# EAGLE design tarjeta_dspic33_proto (EAGLE 4.16)

## Sheet 1 of 7
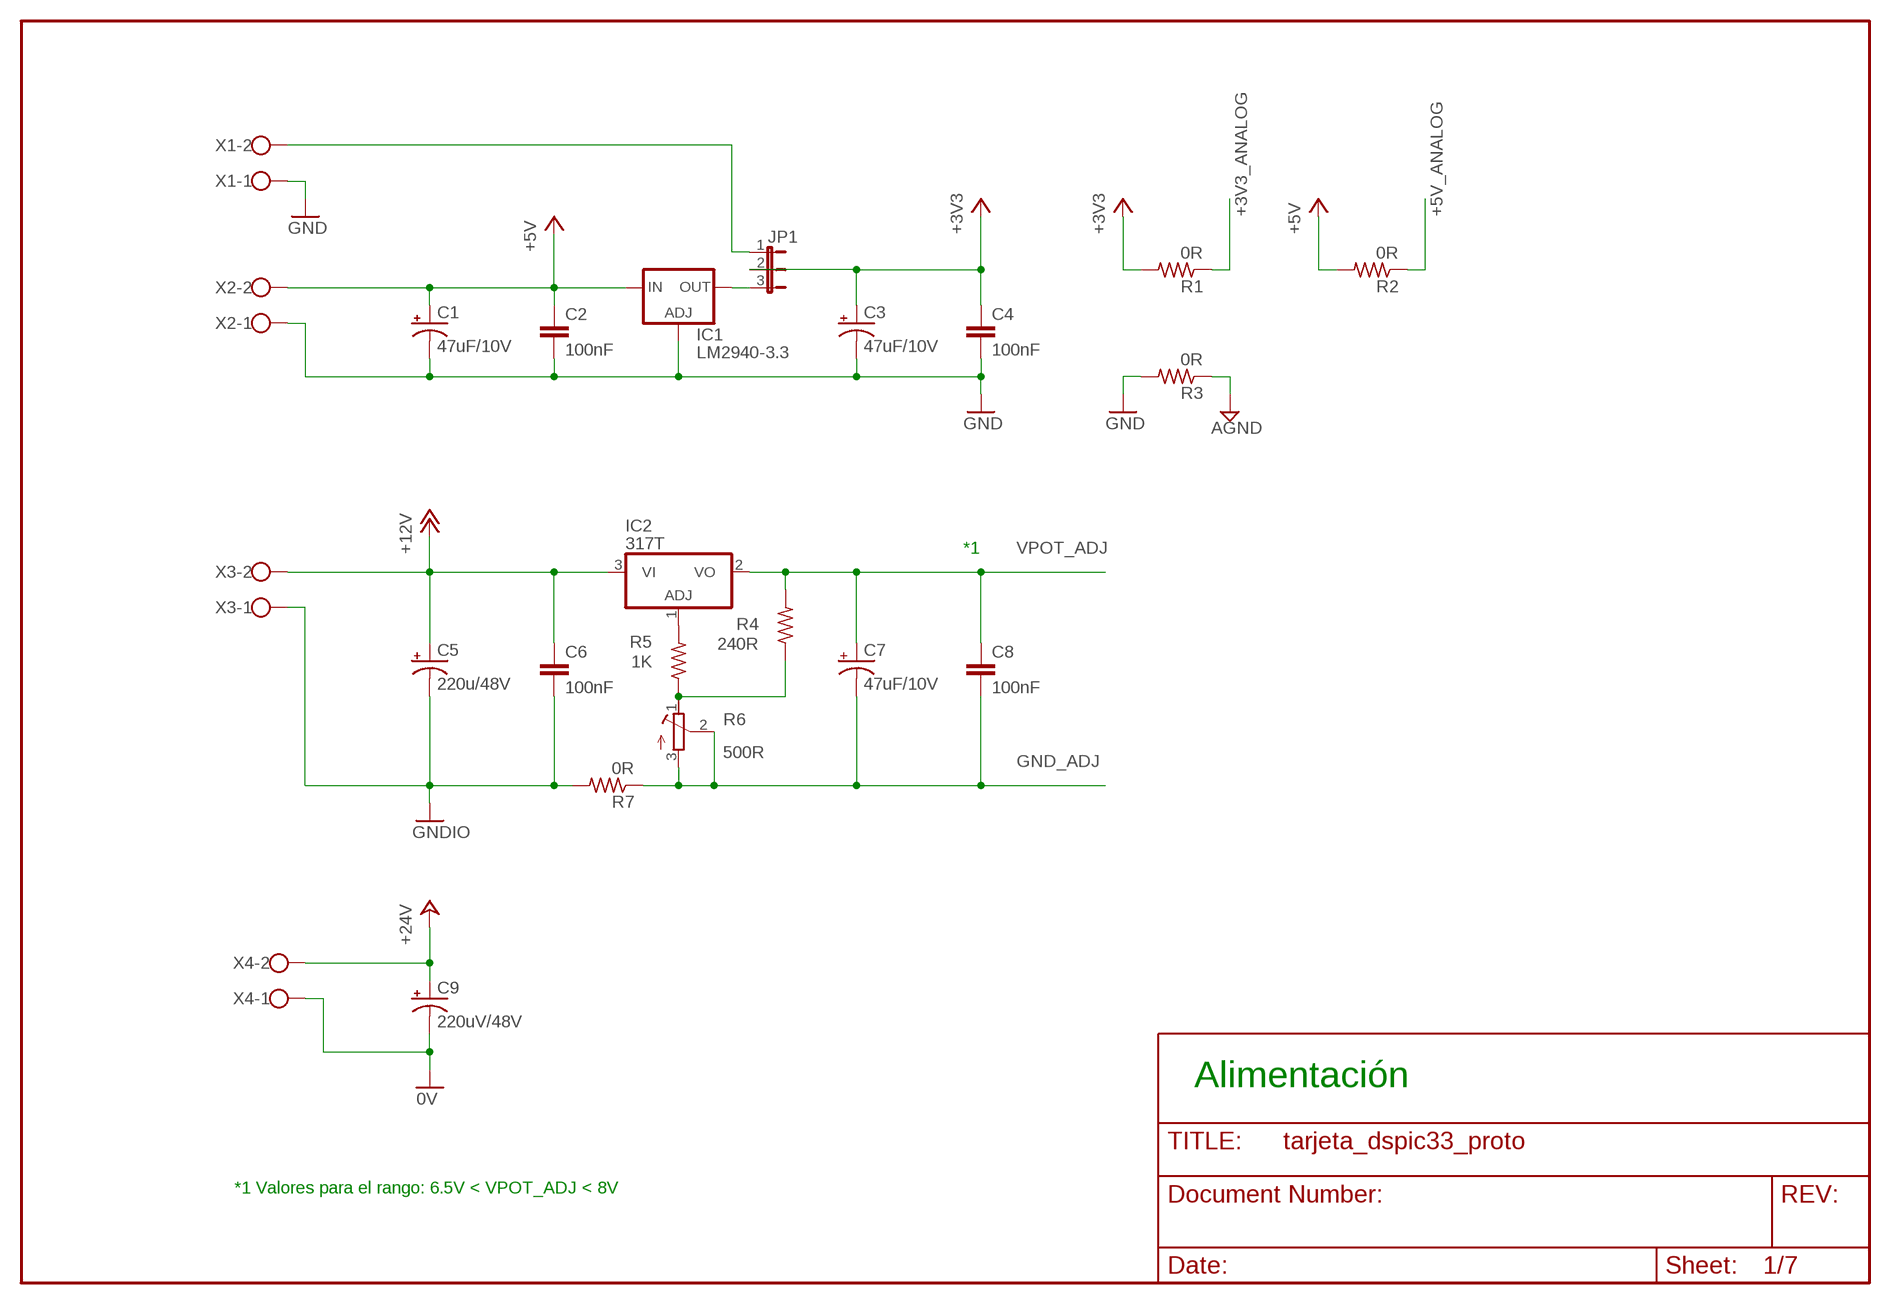
[diagram p0: schematic, sheet 1]

### Parts
C1  47uF/10V  CPOL-USE2-5  [E2-5]
C2  100nF  C-EU050-024X044  [C050-024X044]
C3  47uF/10V  CPOL-USE2-5  [E2-5]
C4  100nF  C-EU050-024X044  [C050-024X044]
C5  220u/48V  CPOL-USE2-5  [E2-5]
C6  100nF  C-EU050-024X044  [C050-024X044]
C7  47uF/10V  CPOL-USE2-5  [E2-5]
C8  100nF  C-EU050-024X044  [C050-024X044]
C9  220uV/48V  CPOL-USE2-5  [E2-5]
IC1  LM2940-3.3  LM317MABT  [TO220L1]
IC2  317T  [TO220H]
JP1  JP2E  [JP2]
R1  0R  R-US_0309/10  [0309/10]
R2  0R  R-US_0309/10  [0309/10]
R3  0R  R-US_0309/10  [0309/10]
R4  240R  R-US_0309/10  [0309/10]
R5  1K  R-US_0309/10  [0309/10]
R6  500R  R-TRIMMT93YA  [RTRIMT93YA]
R7  0R  R-US_0309/10  [0309/10]
X1  W237-02P  [W237-132]
X2  W237-02P  [W237-132]
X3  W237-02P  [W237-132]
X4  W237-02P  [W237-132]

### Nets
0V: C9.- X4.1 ; also sheet 2
+3V3: C3.+ C4.1 JP1.2 R1.2 ; also sheet 3,4,6,7
+3V3_ANALOG: R1.1 ; also sheet 7
+5V: C1.+ C2.1 IC1.3(IN) R2.2 X2.2 ; also sheet 2,3,4
+5V_ANALOG: R2.1 ; also sheet 2,5,7
+12V: C5.+ C6.1 IC2.3(VI) X3.2 ; also sheet 3,4,5
+24V: C9.+ X4.2 ; also sheet 2
AGND: R3.1 ; also sheet 2,5,7
GND: C1.- C2.2 C3.- C4.2 IC1.1(ADJ) R3.2 X1.1 X2.1 ; also sheet 2,3,4,6,7
GND_ADJ: C7.- C8.2 R6.2(S) R6.3(E) R7.1 ; also sheet 3
GNDIO: C5.- C6.2 R7.2 X3.1 ; also sheet 3,4,5
N$3: IC1.2(OUT) JP1.3
N$12: JP1.1 X1.2
N$23: R4.1 R5.1 R6.1(A)
N$24: IC2.1(ADJ) R5.2
VPOT_ADJ: C7.+ C8.1 IC2.2(VO) R4.2 ; also sheet 3

### Notes on the sheet
- *1
- Alimentación
- *1 Valores para el rango: 6.5V < VPOT_ADJ < 8V

## Sheet 2 of 7
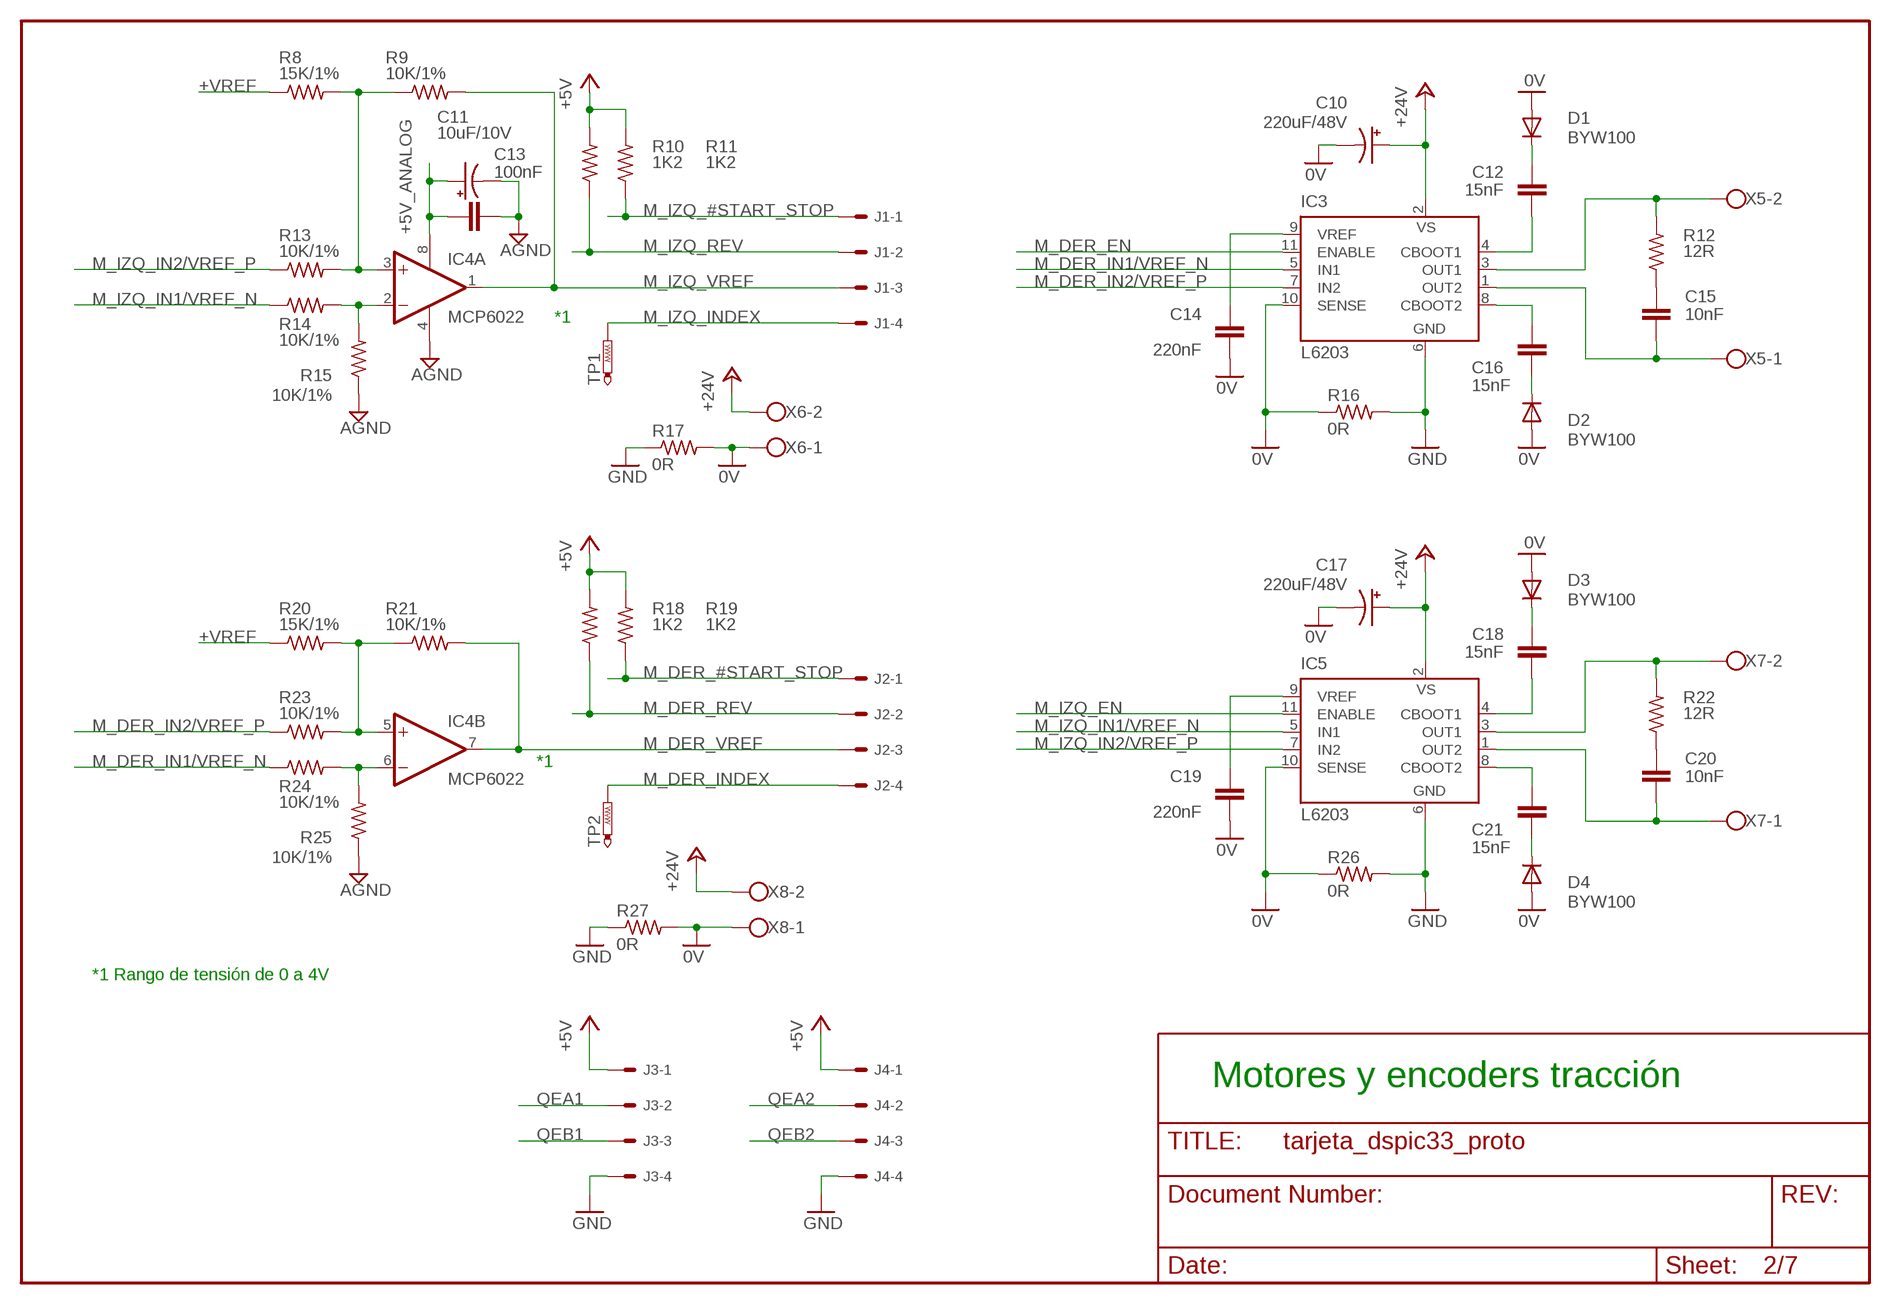
[diagram p1: schematic, sheet 2]

### Parts
C10  220uF/48V  CPOL-USE3.5-10  [E3,5-10]
C11  10uF/10V  CPOL-USE3.5-10  [E3,5-10]
C12  15nF  C-EU050-024X044  [C050-024X044]
C13  100nF  C-EU050-024X044  [C050-024X044]
C14  220nF  C-EU050-024X044  [C050-024X044]
C15  10nF  C-EU050-024X044  [C050-024X044]
C16  15nF  C-EU050-024X044  [C050-024X044]
C17  220uF/48V  CPOL-USE3.5-10  [E3,5-10]
C18  15nF  C-EU050-024X044  [C050-024X044]
C19  220nF  C-EU050-024X044  [C050-024X044]
C20  10nF  C-EU050-024X044  [C050-024X044]
C21  15nF  C-EU050-024X044  [C050-024X044]
D1  BYW100  [F126-10]
D2  BYW100  [F126-10]
D3  BYW100  [F126-10]
D4  BYW100  [F126-10]
IC3  L6203  [MULTIWATT-11]
IC4  MCP6022  OPA2344P  [DIL08]
IC5  L6203  [MULTIWATT-11]
J1  22-27-2041-04  [6410-04]
J2  22-27-2041-04  [6410-04]
J3  22-27-2041-04  [6410-04]
J4  22-27-2041-04  [6410-04]
R8  15K/1%  R-US_0309/10  [0309/10]
R9  10K/1%  R-US_0309/10  [0309/10]
R10  1K2  R-US_0309/10  [0309/10]
R11  1K2  R-US_0309/10  [0309/10]
R12  12R  R-US_0309/10  [0309/10]
R13  10K/1%  R-US_0309/10  [0309/10]
R14  10K/1%  R-US_0309/10  [0309/10]
R15  10K/1%  R-US_0309/10  [0309/10]
R16  0R  R-US_0309/10  [0309/10]
R17  0R  R-US_0309/10  [0309/10]
R18  1K2  R-US_0309/10  [0309/10]
R19  1K2  R-US_0309/10  [0309/10]
R20  15K/1%  R-US_0309/10  [0309/10]
R21  10K/1%  R-US_0309/10  [0309/10]
R22  12R  R-US_0309/10  [0309/10]
R23  10K/1%  R-US_0309/10  [0309/10]
R24  10K/1%  R-US_0309/10  [0309/10]
R25  10K/1%  R-US_0309/10  [0309/10]
R26  0R  R-US_0309/10  [0309/10]
R27  0R  R-US_0309/10  [0309/10]
TP1  PTR1B2,54  [B2,54]
TP2  PTR1B2,54  [B2,54]
X5  W237-02P  [W237-132]
X6  W237-02P  [W237-132]
X7  W237-02P  [W237-132]
X8  W237-02P  [W237-132]

### Nets
0V: C10.- C14.2 C17.- C19.2 D1.A D2.A D3.A D4.A IC3.10(SENSE) IC5.10(SENSE) R16.1 R17.2 R26.1 R27.2 X6.1 X8.1 ; also sheet 1
+5V: J3.1 J4.1 R10.2 R11.2 R18.2 R19.2 ; also sheet 1,3,4
+5V_ANALOG: C11.+ C13.1 IC4.8(A:V+) ; also sheet 1,5,7
+24V: C10.+ C17.+ IC3.2(VS) IC5.2(VS) X6.2 X8.2 ; also sheet 1
+VREF: R8.1 R20.1 ; also sheet 5,7
AGND: C11.- C13.2 IC4.4(A:V-) R15.1 R25.1 ; also sheet 1,5,7
GND: IC3.6(GND) IC5.6(GND) J3.4 J4.4 R16.2 R17.1 R26.2 R27.1 ; also sheet 1,3,4,6,7
M_DER_#START_STOP: J2.1 R19.1 ; also sheet 7
M_DER_EN: IC3.11(ENABLE) ; also sheet 7
M_DER_IN1/VREF_N: IC3.5(IN1) ; also sheet 7
M_DER_IN2/VREF_P: IC3.7(IN2) R23.1 ; also sheet 7
M_DER_INDEX: J2.4 TP2.PP(TP)
M_DER_REV: J2.2 R18.1 ; also sheet 7
M_DER_VREF: IC4.7(B:OUT) J2.3 R21.2
M_IZQ_#START_STOP: J1.1 R11.1 ; also sheet 7
M_IZQ_EN: IC5.11(ENABLE) ; also sheet 7
M_IZQ_IN1/VREF_N: IC5.5(IN1) ; also sheet 7
M_IZQ_IN2/VREF_P: IC5.7(IN2) R13.1 ; also sheet 7
M_IZQ_INDEX: J1.4 TP1.PP(TP)
M_IZQ_REV: J1.2 R10.1 ; also sheet 7
M_IZQ_VREF: IC4.1(A:OUT) J1.3 R9.2
N$4: C14.1 IC3.9(VREF)
N$5: C16.2 D2.C
N$6: C12.2 D1.C
N$7: C16.1 IC3.8(CBOOT2)
N$8: C12.1 IC3.4(CBOOT1)
N$9: IC3.3(OUT1) R12.2 X5.2
N$10: C15.2 R12.1
N$11: C15.1 IC3.1(OUT2) X5.1
N$14: IC4.3(A:+IN) R8.2 R9.1 R13.2
N$15: C19.1 IC5.9(VREF)
N$16: C21.2 D4.C
N$17: C18.2 D3.C
N$18: C21.1 IC5.8(CBOOT2)
N$19: C18.1 IC5.4(CBOOT1)
N$20: C20.2 R22.1
N$21: IC5.3(OUT1) R22.2 X7.2
N$22: C20.1 IC5.1(OUT2) X7.1
N$25: IC4.2(A:-IN) R14.2 R15.2
N$28: IC4.5(B:+IN) R20.2 R21.1 R23.2
N$29: IC4.6(B:-IN) R24.2 R25.2
QEA1: J3.2 ; also sheet 7
QEA2: J4.2 ; also sheet 7
QEB1: J3.3 ; also sheet 7
QEB2: J4.3 ; also sheet 7
Unconnected: R14.1 R24.1

### Notes on the sheet
- *1
- *1
- *1 Rango de tensión de 0 a 4V
- Motores y encoders tracción

## Sheet 3 of 7
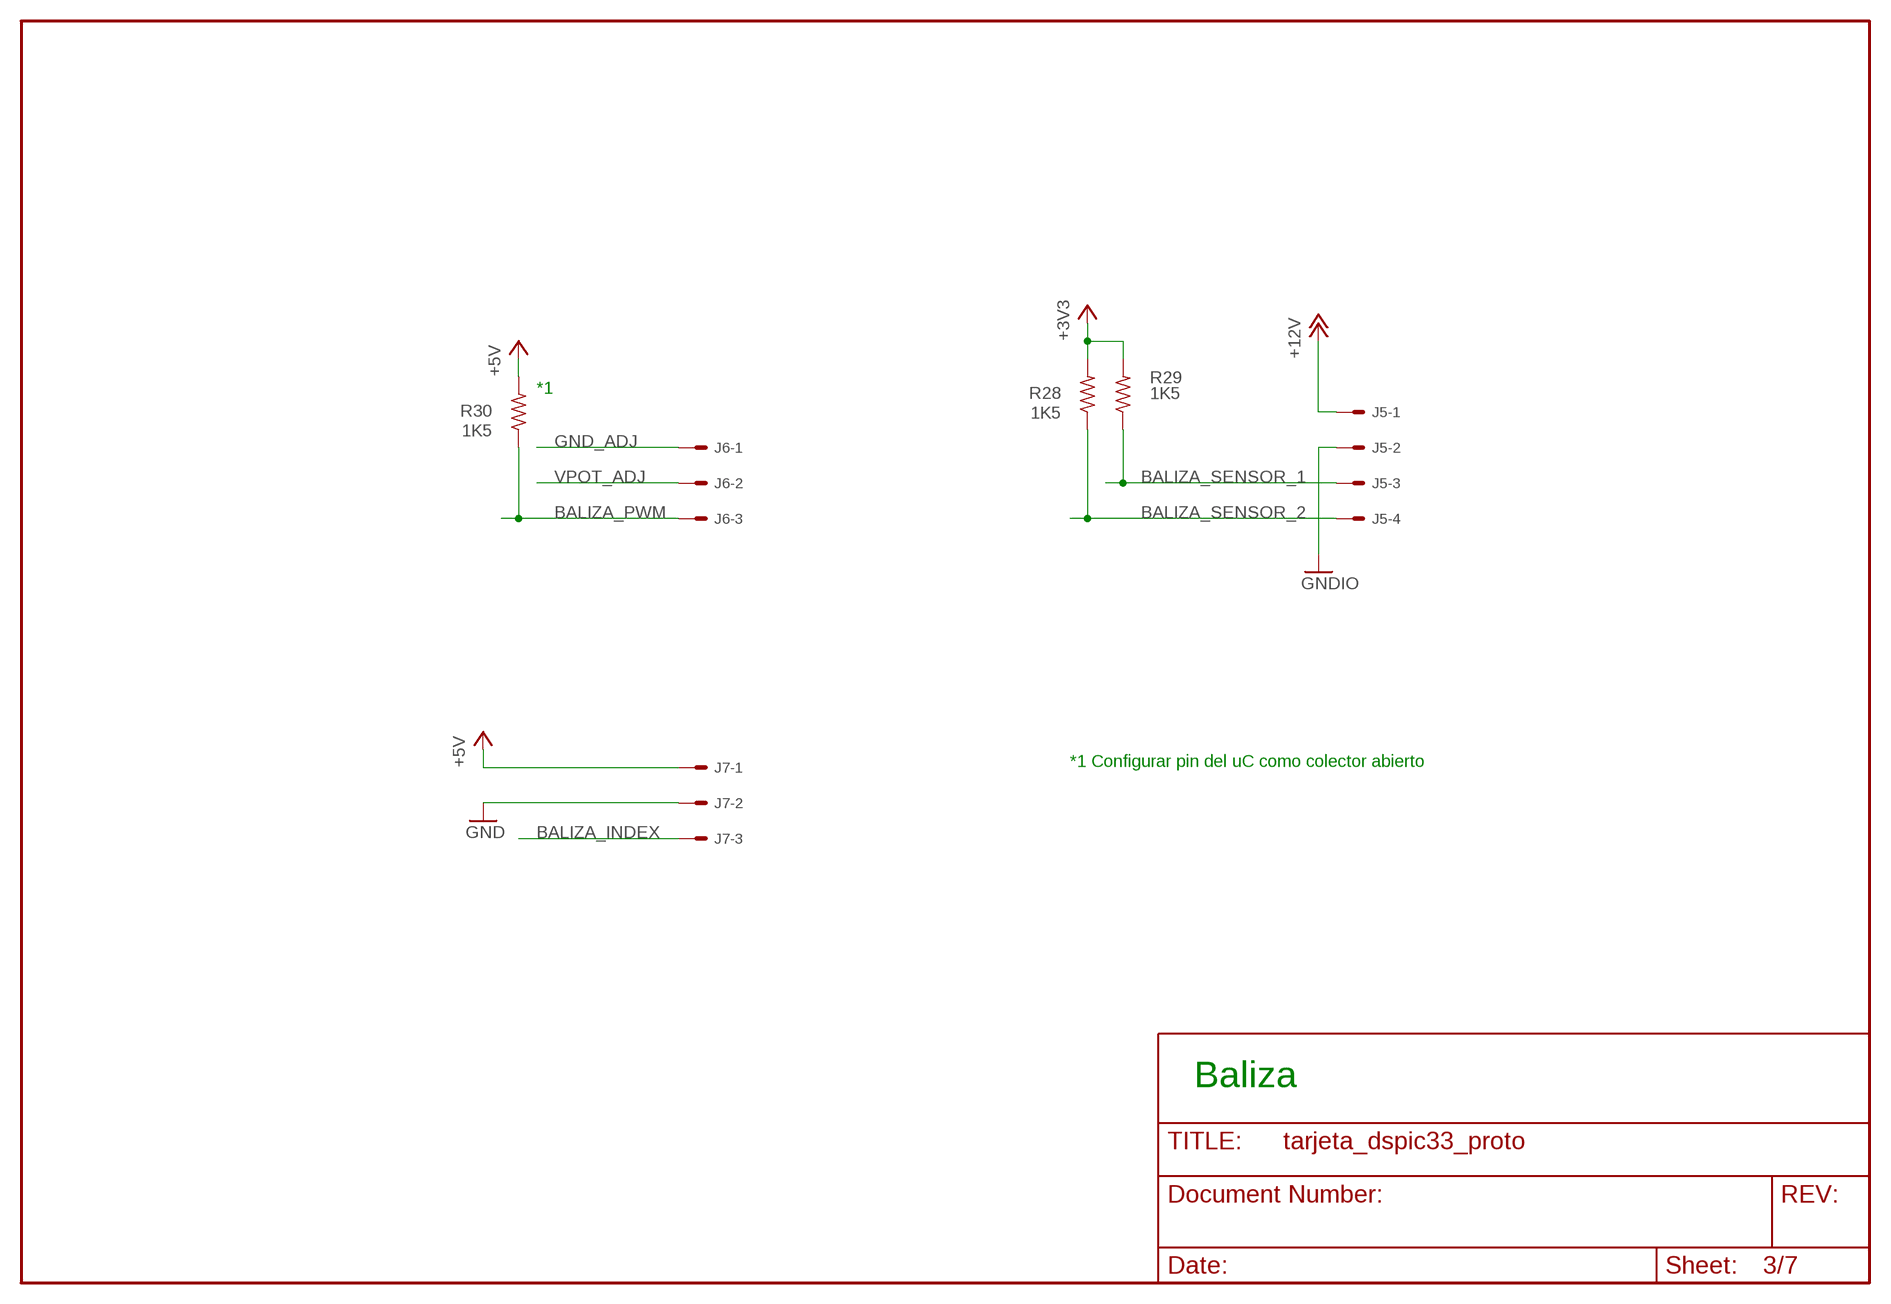
[diagram p2: schematic, sheet 3]

### Parts
J5  22-27-2041-04  [6410-04]
J6  22-27-2031-03  [6410-03]
J7  22-27-2031-03  [6410-03]
R28  1K5  R-US_0207/7  [0207/7]
R29  1K5  R-US_0207/7  [0207/7]
R30  1K5  R-US_0207/7  [0207/7]

### Nets
+3V3: R28.2 R29.2 ; also sheet 1,4,6,7
+5V: J7.1 R30.2 ; also sheet 1,2,4
+12V: J5.1 ; also sheet 1,4,5
BALIZA_INDEX: J7.3 ; also sheet 7
BALIZA_PWM: J6.3 R30.1 ; also sheet 7
BALIZA_SENSOR_1: J5.3 R29.1 ; also sheet 7
BALIZA_SENSOR_2: J5.4 R28.1 ; also sheet 7
GND: J7.2 ; also sheet 1,2,4,6,7
GND_ADJ: J6.1 ; also sheet 1
GNDIO: J5.2 ; also sheet 1,4,5
VPOT_ADJ: J6.2 ; also sheet 1

### Notes on the sheet
- *1
- *1 Configurar pin del uC como colector abierto
- Baliza

## Sheet 4 of 7
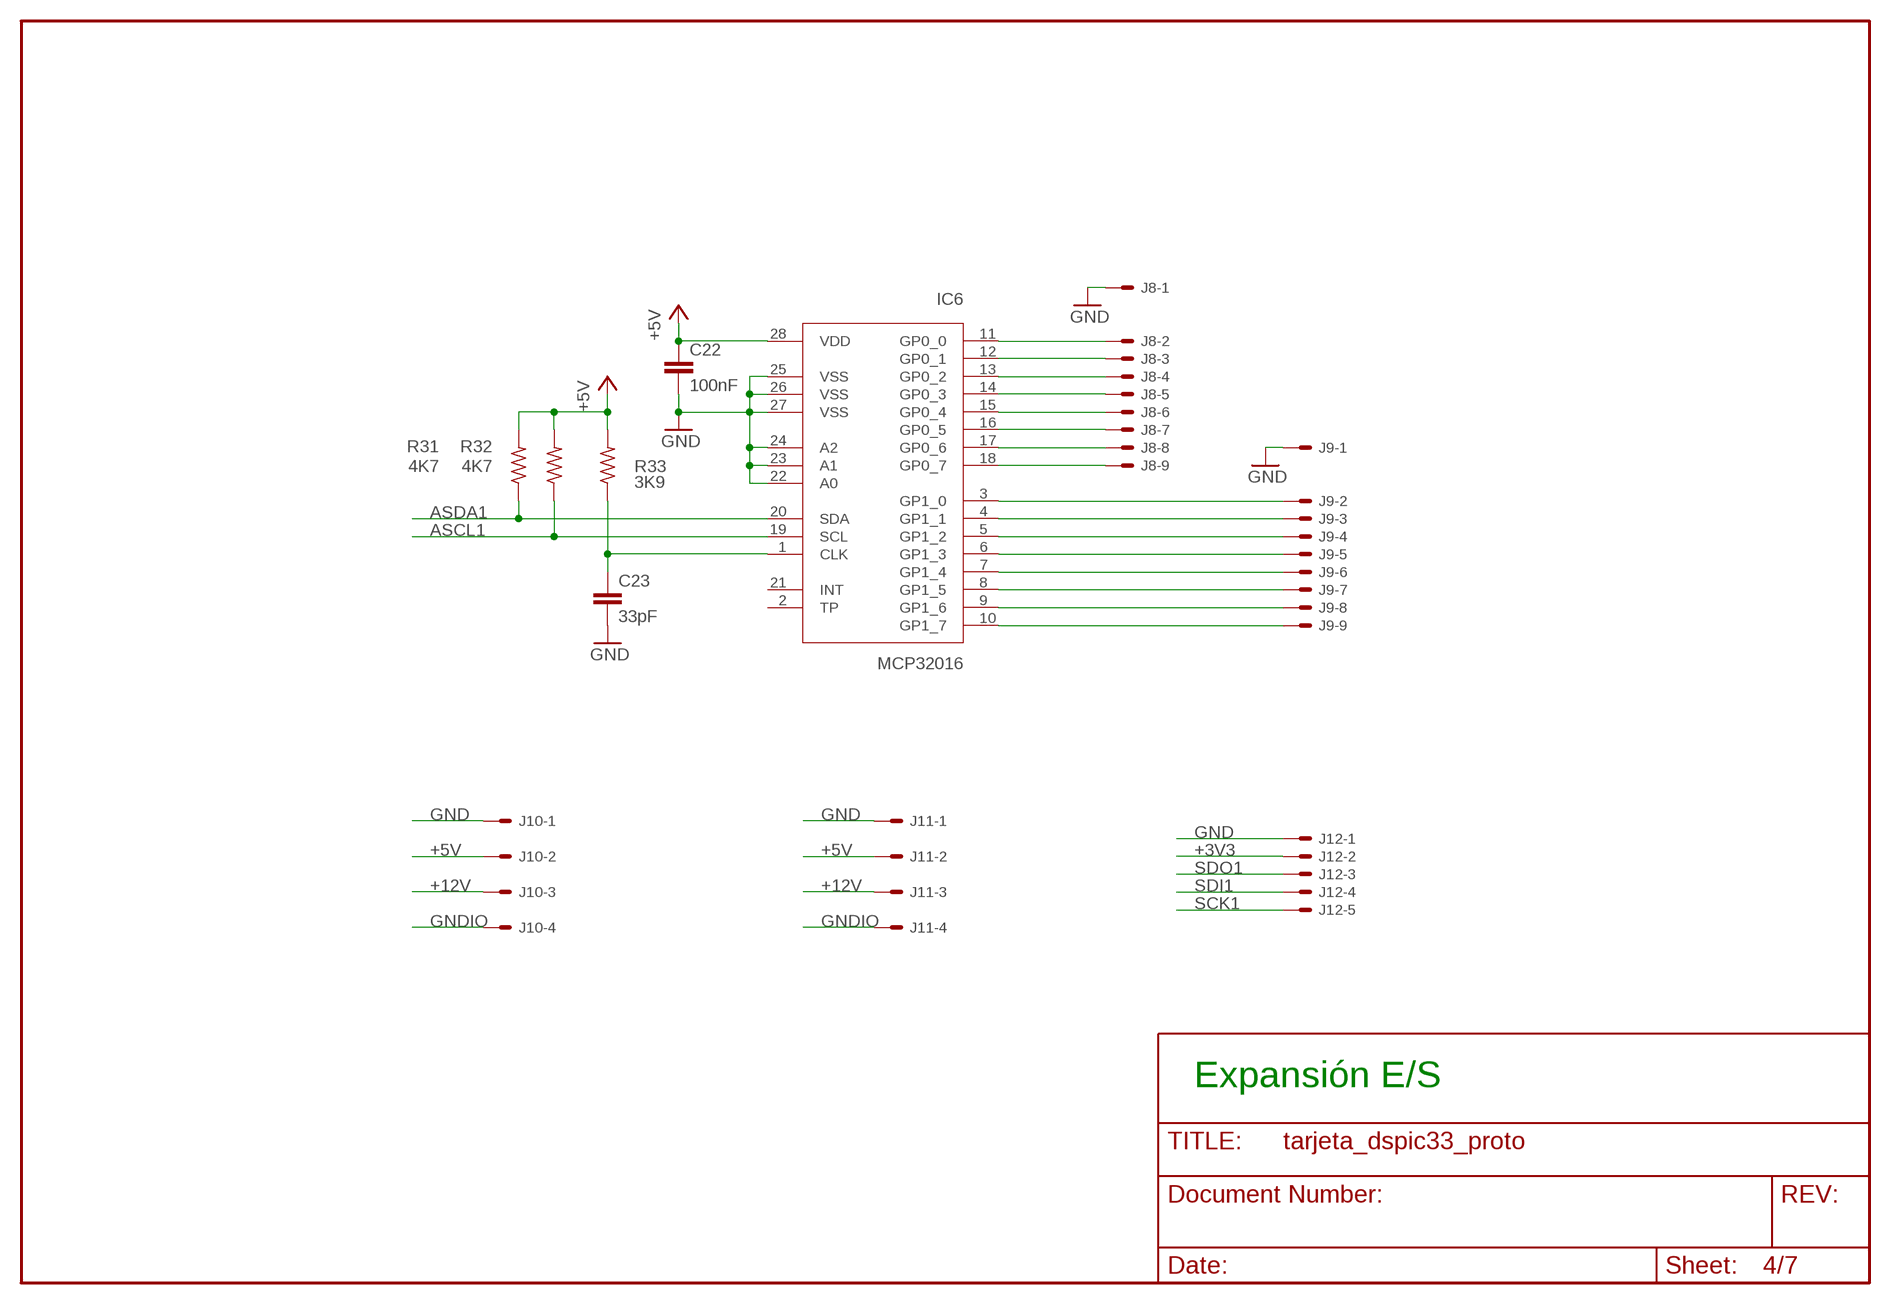
[diagram p3: schematic, sheet 4]

### Parts
C22  100nF  C-EU050-024X044  [C050-024X044]
C23  33pF  C-EU050-024X044  [C050-024X044]
IC6  MCP32016  [DIL28-3]
J8  22-27-2091-09  [6410-09]
J9  22-27-2091-09  [6410-09]
J10  22-27-2041-04  [6410-04]
J11  22-27-2041-04  [6410-04]
J12  22-27-2051-05  [6410-05]
R31  4K7  R-US_0207/7  [0207/7]
R32  4K7  R-US_0207/7  [0207/7]
R33  3K9  R-US_0207/7  [0207/7]

### Nets
+3V3: J12.2 ; also sheet 1,3,6,7
+5V: C22.1 IC6.28(VDD) J10.2 J11.2 R31.2 R32.2 R33.2 ; also sheet 1,2,3
+12V: J10.3 J11.3 ; also sheet 1,3,5
ASCL1: IC6.19(SCL) R32.1 ; also sheet 7
ASDA1: IC6.20(SDA) R31.1 ; also sheet 7
GND: C22.2 C23.2 IC6.22(A0) IC6.23(A1) IC6.24(A2) IC6.25(VSS) IC6.26(VSS) IC6.27(VSS) J8.1 J9.1 J10.1 J11.1 J12.1 ; also sheet 1,2,3,6,7
GNDIO: J10.4 J11.4 ; also sheet 1,3,5
N$26: C23.1 IC6.1(CLK) R33.1
N$35: IC6.7(GP1_4) J9.6
N$41: IC6.3(GP1_0) J9.2
N$42: IC6.11(GP0_0) J8.2
N$43: IC6.12(GP0_1) J8.3
N$44: IC6.13(GP0_2) J8.4
N$45: IC6.14(GP0_3) J8.5
N$46: IC6.15(GP0_4) J8.6
N$47: IC6.16(GP0_5) J8.7
N$48: IC6.17(GP0_6) J8.8
N$49: IC6.18(GP0_7) J8.9
N$50: IC6.4(GP1_1) J9.3
N$51: IC6.5(GP1_2) J9.4
N$52: IC6.6(GP1_3) J9.5
N$53: IC6.8(GP1_5) J9.7
N$54: IC6.9(GP1_6) J9.8
N$55: IC6.10(GP1_7) J9.9
SCK1: J12.5 ; also sheet 7
SDI1: J12.4 ; also sheet 7
SDO1: J12.3 ; also sheet 7
Unconnected: IC6.2(TP) IC6.21(INT)

### Notes on the sheet
- Expansión E/S

## Sheet 5 of 7
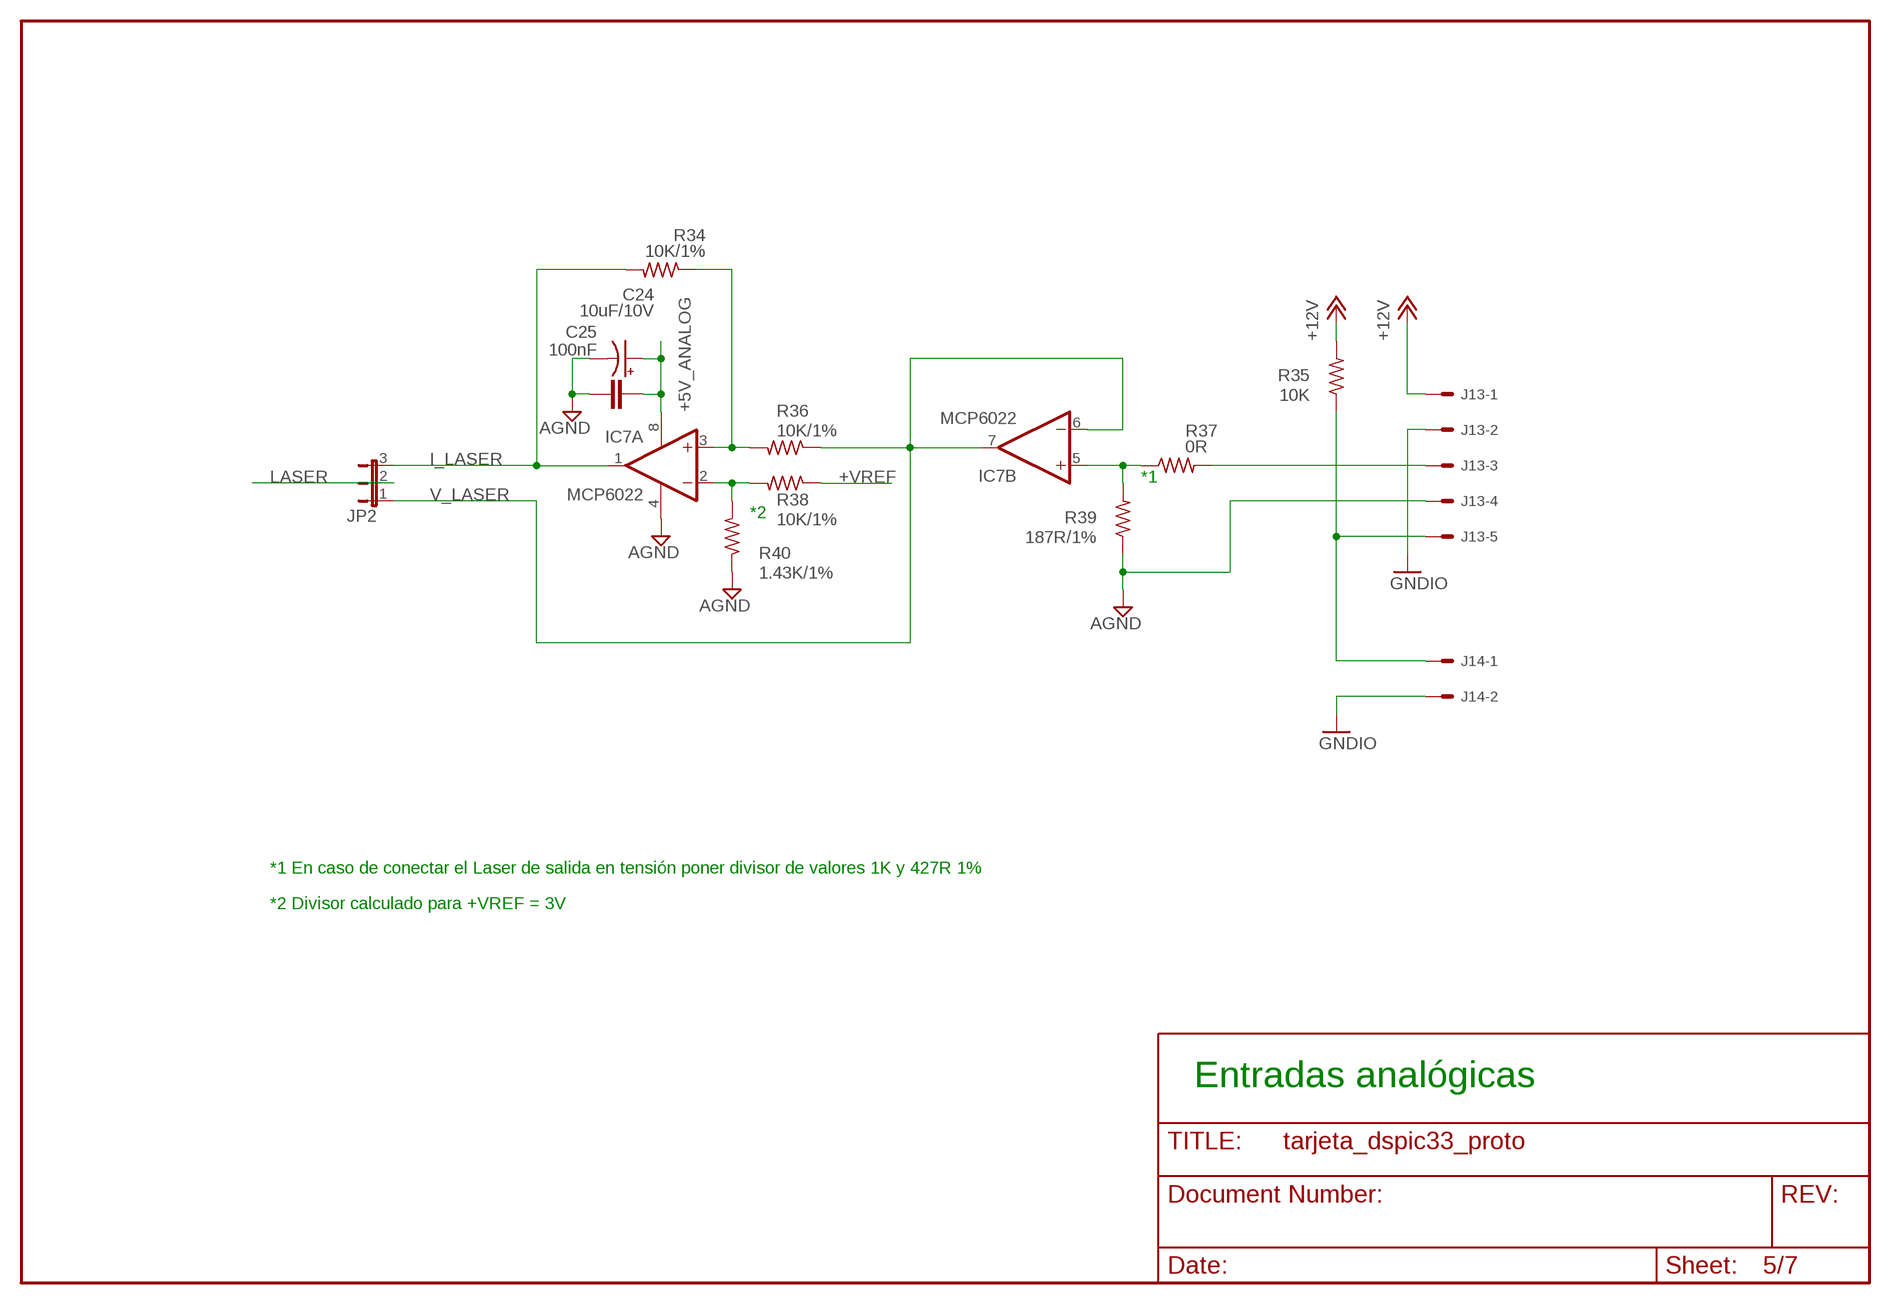
[diagram p4: schematic, sheet 5]

### Parts
C24  10uF/10V  CPOL-USE3.5-10  [E3,5-10]
C25  100nF  C-EU050-024X044  [C050-024X044]
IC7  MCP6022  OPA2344P  [DIL08]
J13  22-27-2051-05  [6410-05]
J14  22-27-2021-02  [6410-02]
JP2  JP2E  [JP2]
R34  10K/1%  R-US_0309/10  [0309/10]
R35  10K  R-US_0207/7  [0207/7]
R36  10K/1%  R-US_0309/10  [0309/10]
R37  0R  R-US_0207/7  [0207/7]
R38  10K/1%  R-US_0309/10  [0309/10]
R39  187R/1%  R-US_0207/7  [0207/7]
R40  1.43K/1%  R-US_0309/10  [0309/10]

### Nets
+5V_ANALOG: C24.+ C25.1 IC7.8(A:V+) ; also sheet 1,2,7
+12V: J13.1 R35.2 ; also sheet 1,3,4
+VREF: R38.1 ; also sheet 2,7
AGND: C24.- C25.2 IC7.4(A:V-) J13.4 R39.1 R40.1 ; also sheet 1,2,7
GNDIO: J13.2 J14.2 ; also sheet 1,3,4
I_LASER: IC7.1(A:OUT) JP2.3 R34.2
LASER: JP2.2 ; also sheet 7
N$36: IC7.3(A:+IN) R34.1 R36.2
N$37: J13.3 R37.2
N$38: IC7.5(B:+IN) R37.1 R39.2
N$39: J13.5 J14.1 R35.1
N$40: IC7.2(A:-IN) R38.2 R40.2
V_LASER: IC7.6(B:-IN) IC7.7(B:OUT) JP2.1 R36.1

### Notes on the sheet
- *1
- *2
- *1 En caso de conectar el Laser de salida en tensión poner divisor de valores 1K y 427R 1%
- *2 Divisor calculado para +VREF = 3V
- Entradas analógicas

## Sheet 6 of 7
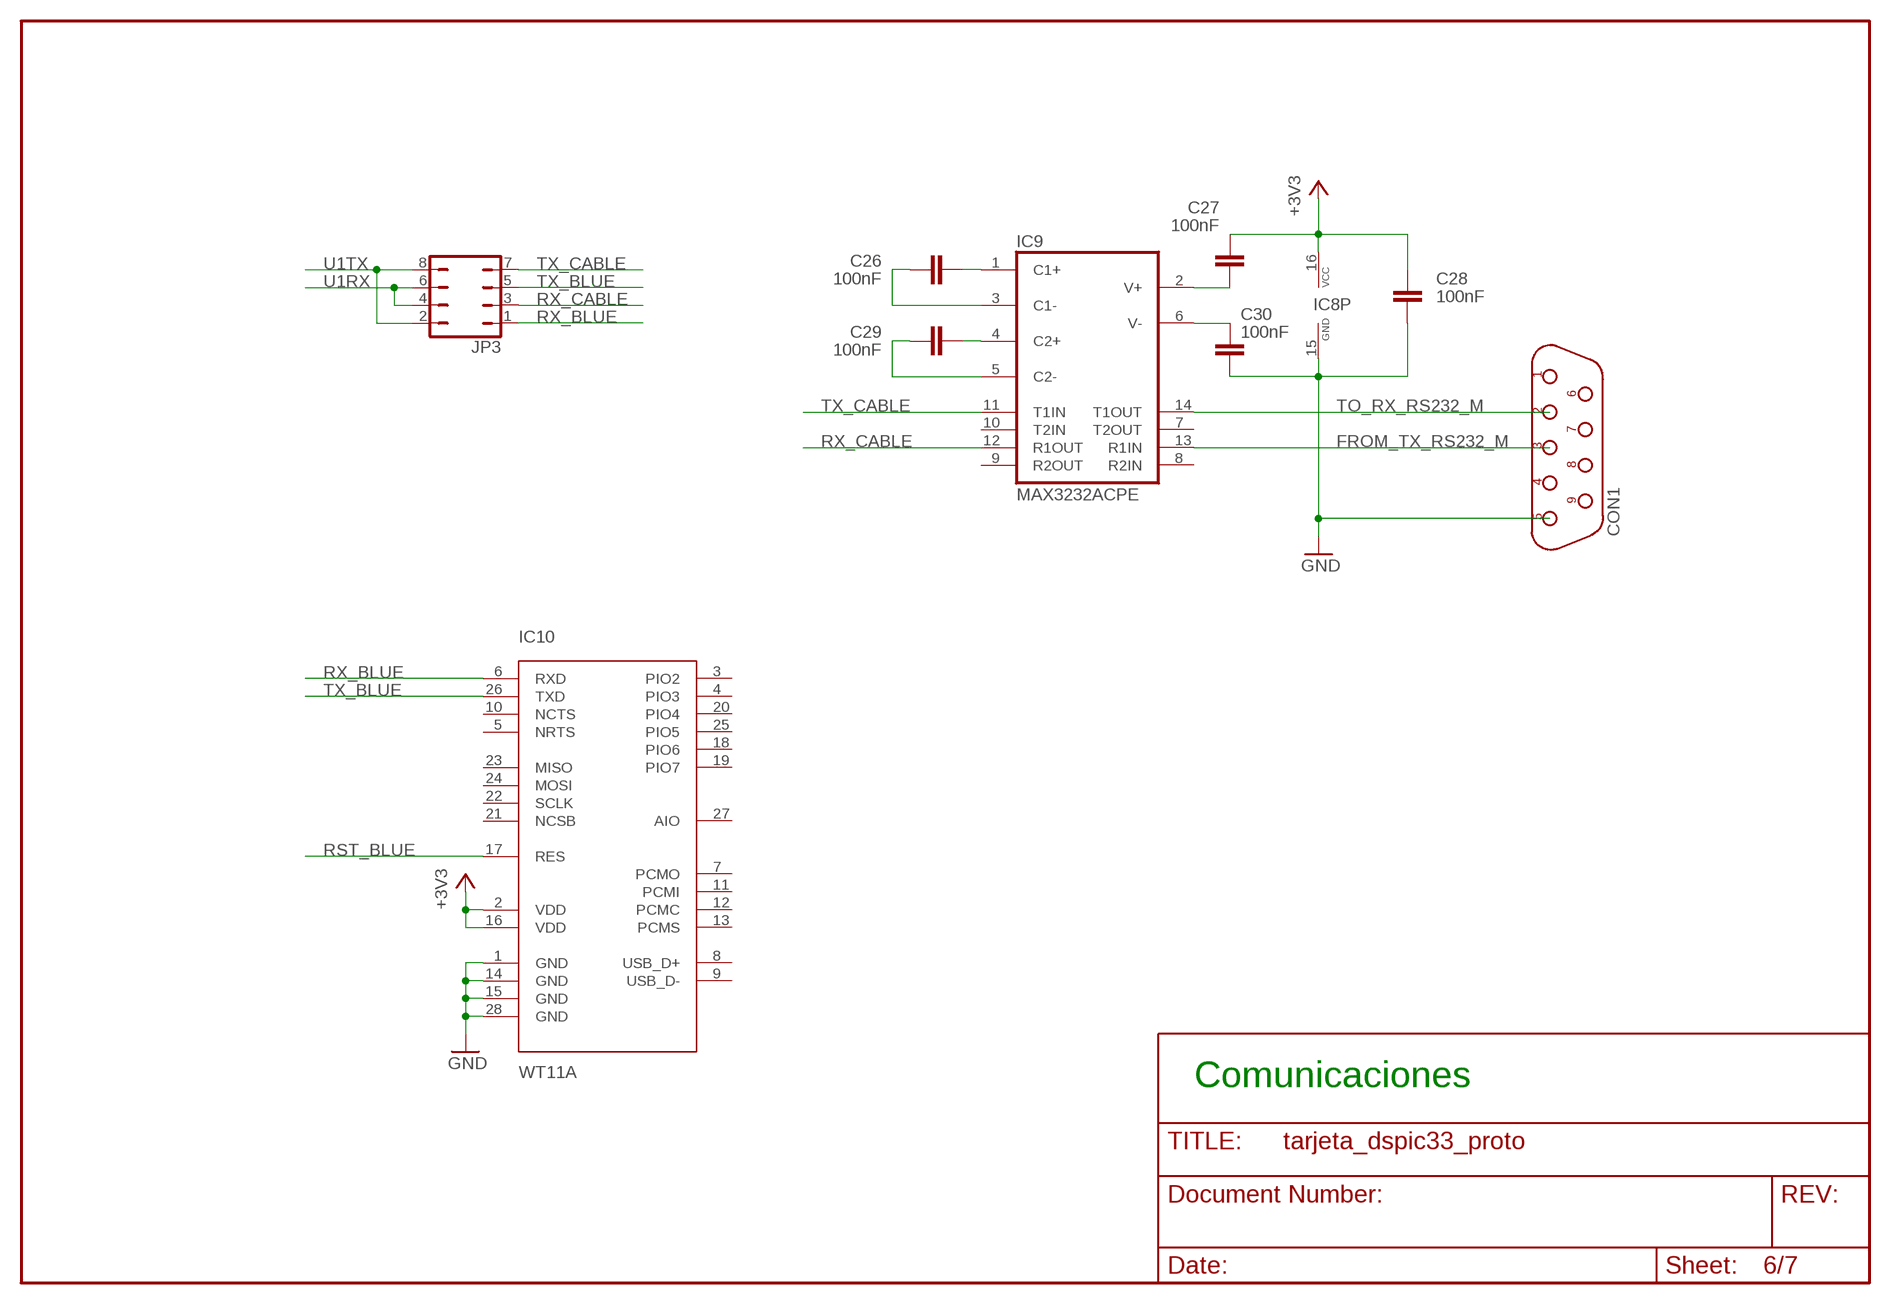
[diagram p5: schematic, sheet 6]

### Parts
C26  100nF  C-EU050-024X044  [C050-024X044]
C27  100nF  C-EU050-024X044  [C050-024X044]
C28  100nF  C-EU050-024X044  [C050-024X044]
C29  100nF  C-EU050-024X044  [C050-024X044]
C30  100nF  C-EU050-024X044  [C050-024X044]
CON1  DB9F/90  [D-09F/90]
IC8  MAX232  [DIL16]
IC9  MAX3232ACPE  MAX232ACPE  [DIL16]
IC10  WT11A  [WT11]
JP3  JP4Q  [JP4Q]

### Nets
+3V3: C27.2 C28.2 IC8.16(VCC) IC10.2(VDD) IC10.16(VDD) ; also sheet 1,3,4,7
FROM_TX_RS232_M: CON1.3 IC9.13(R1IN)
GND: C28.1 C30.1 CON1.5 IC8.15(GND) IC10.1(GND) IC10.14(GND) IC10.15(GND) IC10.28(GND) ; also sheet 1,2,3,4,7
N$27: C26.2 IC9.1(C1+)
N$30: C26.1 IC9.3(C1-)
N$31: C29.2 IC9.4(C2+)
N$32: C29.1 IC9.5(C2-)
N$33: C27.1 IC9.2(V+)
N$34: C30.2 IC9.6(V-)
RST_BLUE: IC10.17(RES) ; also sheet 7
RX_BLUE: IC10.6(RXD) JP3.1
RX_CABLE: IC9.12(R1OUT) JP3.3
TO_RX_RS232_M: CON1.2 IC9.14(T1OUT)
TX_BLUE: IC10.26(TXD) JP3.5
TX_CABLE: IC9.11(T1IN) JP3.7
U1RX: JP3.4 JP3.6 ; also sheet 7
U1TX: JP3.2 JP3.8 ; also sheet 7
Unconnected: CON1.1 CON1.4 CON1.6 CON1.7 CON1.8 CON1.9 IC8.1(C1+) IC8.2(V+) IC8.3(C1-) IC8.4(C2+) IC8.5(C2-) IC8.6(V-) IC8.7(T2OUT) IC8.8(R2IN) IC8.9(R2OUT) IC8.10(T2IN) IC8.11(T1IN) IC8.12(R1OUT) IC8.13(R1IN) IC8.14(T1OUT) IC9.7(T2OUT) IC9.8(R2IN) IC9.9(R2OUT) IC9.10(T2IN) IC10.3(PIO2) IC10.4(PIO3) IC10.5(NRTS) IC10.7(PCMO) IC10.8(USB_D+) IC10.9(USB_D-) IC10.10(NCTS) IC10.11(PCMI) IC10.12(PCMC) IC10.13(PCMS) IC10.18(PIO6) IC10.19(PIO7) IC10.20(PIO4) IC10.21(NCSB) IC10.22(SCLK) IC10.23(MISO) IC10.24(MOSI) IC10.25(PIO5) IC10.27(AIO)

### Notes on the sheet
- Comunicaciones

## Sheet 7 of 7
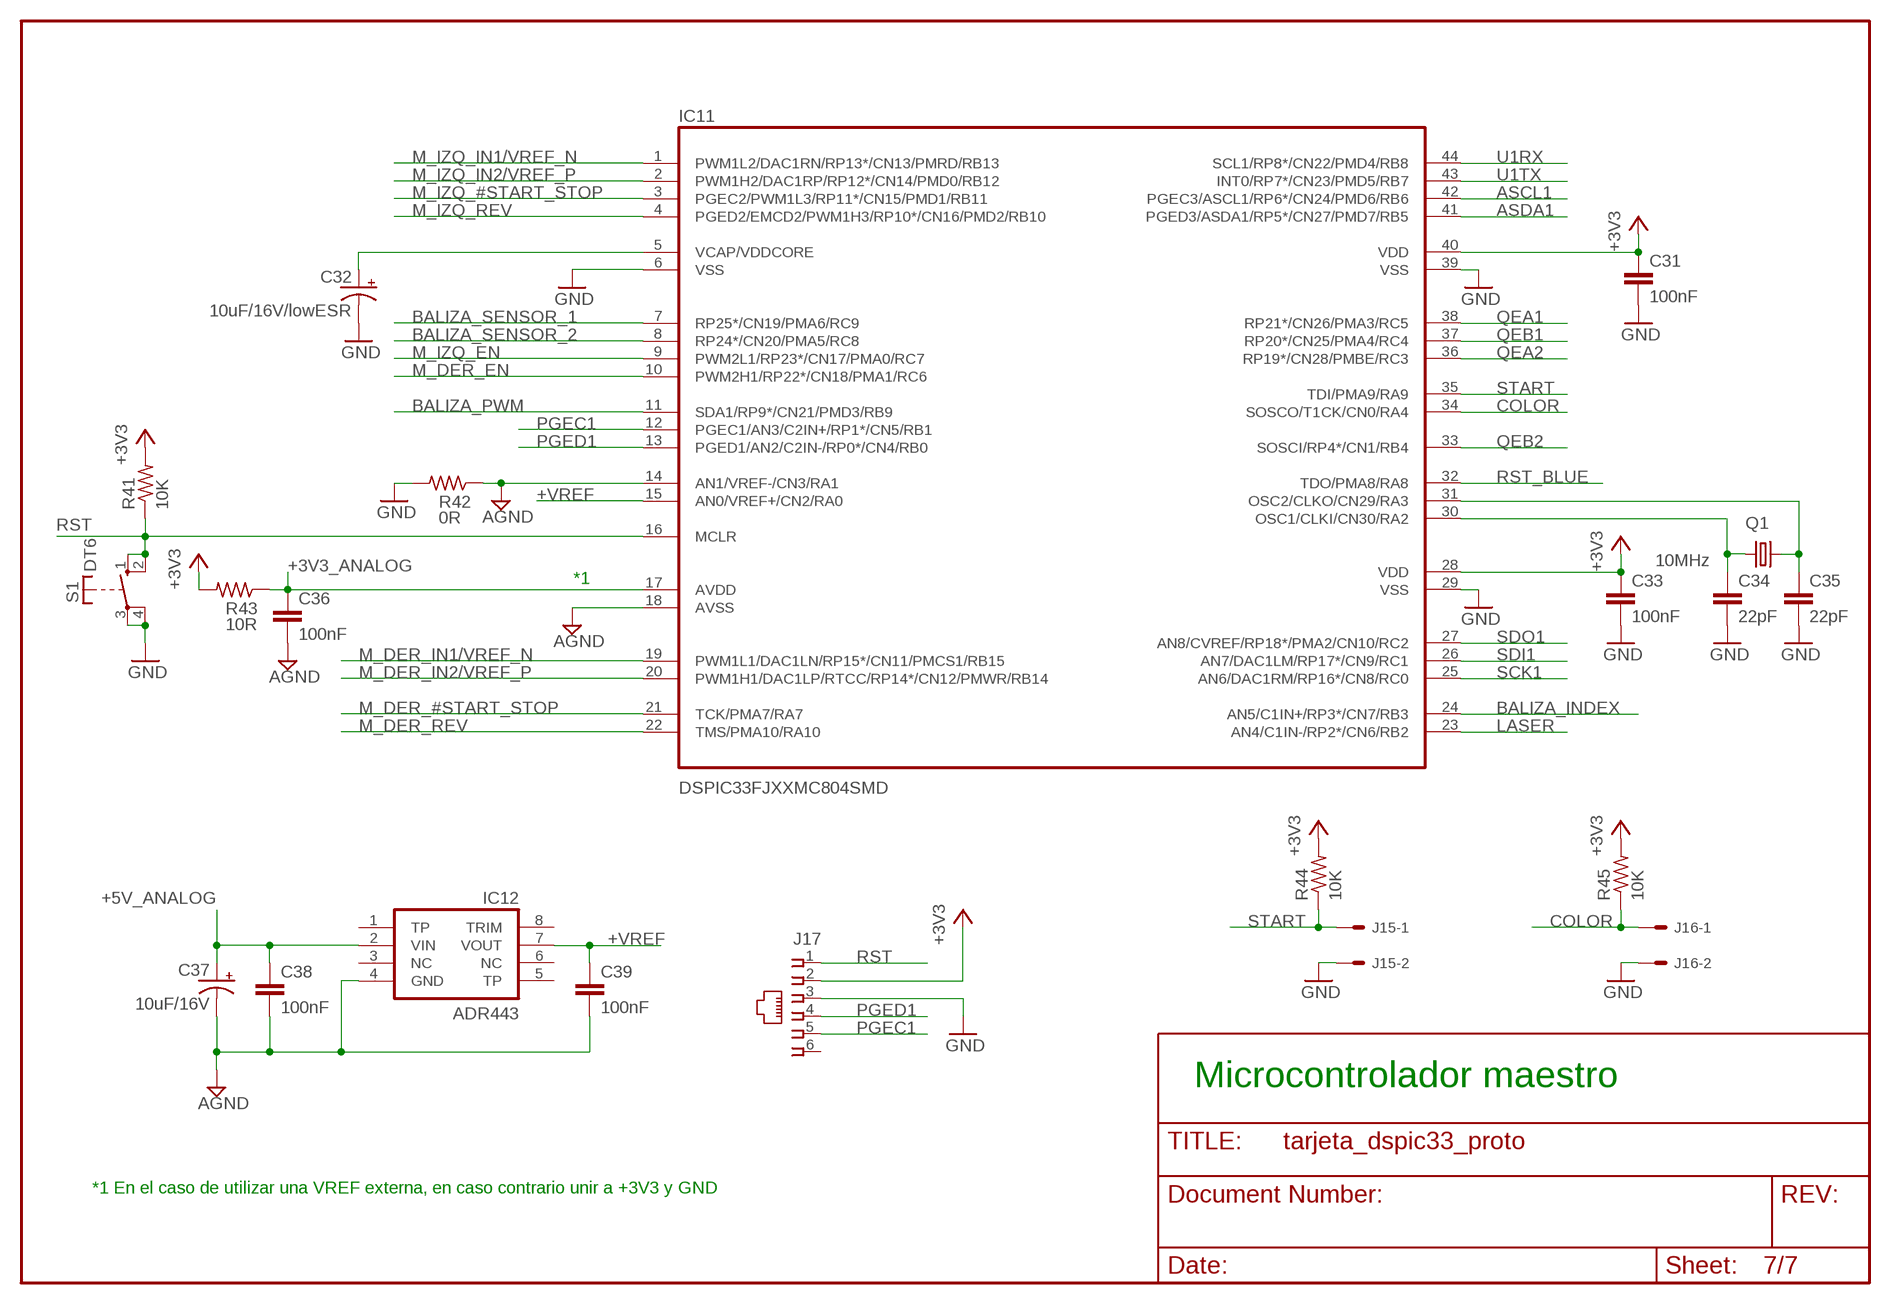
[diagram p6: schematic, sheet 7]

### Parts
C31  100nF  C-EU050-024X044  [C050-024X044]
C32  10uF/16V/lowESR  CPOL-USE3.5-8  [E3,5-8]
C33  100nF  C-EU050-024X044  [C050-024X044]
C34  22pF  C-EU050-024X044  [C050-024X044]
C35  22pF  C-EU050-024X044  [C050-024X044]
C36  100nF  C-EU050-024X044  [C050-024X044]
C37  10uF/16V  CPOL-USE3.5-8  [E3,5-8]
C38  100nF  C-EU050-024X044  [C050-024X044]
C39  100nF  C-EU050-024X044  [C050-024X044]
IC11  DSPIC33FJXXMC804SMD  [TQFP44]
IC12  ADR443  [SOIC8]
J15  22-27-2021-02  [6410-02]
J16  22-27-2021-02  [6410-02]
J17  520470-3  [520470-3]
Q1  10MHz  CRYSTALHC49U-H  [HC49U-H]
R41  10K  R-US_0204/7  [0204/7]
R42  0R  R-US_0207/7  [0207/7]
R43  10R  R-US_0207/7  [0207/7]
R44  10K  R-US_0207/7  [0207/7]
R45  10K  R-US_0207/7  [0207/7]
S1  DT6  [DT6]

### Nets
+3V3: C31.1 C33.1 IC11.28(VDD) IC11.40(VDD) J17.2 R41.2 R43.2 R44.2 R45.2 ; also sheet 1,3,4,6
+3V3_ANALOG: C36.1 IC11.17(AVDD) R43.1 ; also sheet 1
+5V_ANALOG: C37.+ C38.1 IC12.2(VIN) ; also sheet 1,2,5
+VREF: C39.1 IC11.15(AN0/VREF+/CN2/RA0) IC12.7(VOUT) ; also sheet 2,5
AGND: C36.2 C37.- C38.2 C39.2 IC11.14(AN1/VREF-/CN3/RA1) IC11.18(AVSS) IC12.4(GND) R42.1 ; also sheet 1,2,5
ASCL1: IC11.42(PGEC3/ASCL1/RP6*/CN24/PMD6/RB6) ; also sheet 4
ASDA1: IC11.41(PGED3/ASDA1/RP5*/CN27/PMD7/RB5) ; also sheet 4
BALIZA_INDEX: IC11.24(AN5/C1IN+/RP3*/CN7/RB3) ; also sheet 3
BALIZA_PWM: IC11.11(SDA1/RP9*/CN21/PMD3/RB9) ; also sheet 3
BALIZA_SENSOR_1: IC11.7(RP25*/CN19/PMA6/RC9) ; also sheet 3
BALIZA_SENSOR_2: IC11.8(RP24*/CN20/PMA5/RC8) ; also sheet 3
COLOR: IC11.34(SOSCO/T1CK/CN0/RA4) J16.1 R45.1
GND: C31.2 C32.- C33.2 C34.2 C35.2 IC11.6(VSS) IC11.29(VSS) IC11.39(VSS) J15.2 J16.2 J17.3 R42.2 S1.3(P) S1.4(P) ; also sheet 1,2,3,4,6
LASER: IC11.23(AN4/C1IN-/RP2*/CN6/RB2) ; also sheet 5
M_DER_#START_STOP: IC11.21(TCK/PMA7/RA7) ; also sheet 2
M_DER_EN: IC11.10(PWM2H1/RP22*/CN18/PMA1/RC6) ; also sheet 2
M_DER_IN1/VREF_N: IC11.19(PWM1L1/DAC1LN/RP15*/CN11/PMCS1/RB15) ; also sheet 2
M_DER_IN2/VREF_P: IC11.20(PWM1H1/DAC1LP/RTCC/RP14*/CN12/PMWR/RB14) ; also sheet 2
M_DER_REV: IC11.22(TMS/PMA10/RA10) ; also sheet 2
M_IZQ_#START_STOP: IC11.3(PGEC2/PWM1L3/RP11*/CN15/PMD1/RB11) ; also sheet 2
M_IZQ_EN: IC11.9(PWM2L1/RP23*/CN17/PMA0/RC7) ; also sheet 2
M_IZQ_IN1/VREF_N: IC11.1(PWM1L2/DAC1RN/RP13*/CN13/PMRD/RB13) ; also sheet 2
M_IZQ_IN2/VREF_P: IC11.2(PWM1H2/DAC1RP/RP12*/CN14/PMD0/RB12) ; also sheet 2
M_IZQ_REV: IC11.4(PGED2/EMCD2/PWM1H3/RP10*/CN16/PMD2/RB10) ; also sheet 2
N$1: C32.+ IC11.5(VCAP/VDDCORE)
N$2: C35.1 IC11.31(OSC2/CLKO/CN29/RA3) Q1.2
N$13: C34.1 IC11.30(OSC1/CLKI/CN30/RA2) Q1.1
PGEC1: IC11.12(PGEC1/AN3/C2IN+/RP1*/CN5/RB1) J17.5
PGED1: IC11.13(PGED1/AN2/C2IN-/RP0*/CN4/RB0) J17.4
QEA1: IC11.38(RP21*/CN26/PMA3/RC5) ; also sheet 2
QEA2: IC11.36(RP19*/CN28/PMBE/RC3) ; also sheet 2
QEB1: IC11.37(RP20*/CN25/PMA4/RC4) ; also sheet 2
QEB2: IC11.33(SOSCI/RP4*/CN1/RB4) ; also sheet 2
RST: IC11.16(MCLR) J17.1 R41.1 S1.1(S) S1.2(S)
RST_BLUE: IC11.32(TDO/PMA8/RA8) ; also sheet 6
SCK1: IC11.25(AN6/DAC1RM/RP16*/CN8/RC0) ; also sheet 4
SDI1: IC11.26(AN7/DAC1LM/RP17*/CN9/RC1) ; also sheet 4
SDO1: IC11.27(AN8/CVREF/RP18*/PMA2/CN10/RC2) ; also sheet 4
START: IC11.35(TDI/PMA9/RA9) J15.1 R44.1
U1RX: IC11.44(SCL1/RP8*/CN22/PMD4/RB8) ; also sheet 6
U1TX: IC11.43(INT0/RP7*/CN23/PMD5/RB7) ; also sheet 6
Unconnected: IC12.1(TP) IC12.3(NC) IC12.5(TP) IC12.6(NC) IC12.8(TRIM) J17.6

### Notes on the sheet
- *1
- Microcontrolador maestro
- *1 En el caso de utilizar una VREF externa, en caso contrario unir a +3V3 y GND

## Power pins joined to a net without a drawn wire
GND: IC9.15(GND)
VCC: IC9.16(VCC)

## Library data of the parts
C1 C3 C5 C7 C9-C11 C17 C24 C32 C37 = rcl:CPOL-US: POLARIZED CAPACITOR, American symbol
C2 C4 C6 C8 C12-C16 C18-C23 C25-C31 C33-C36 C38 C39 = rcl:C-EU: CAPACITOR, European symbol
CON1 = connect:DB9F/90
D1-D4 = diode:BYW100: DIODE high-efficiency fast rectifier (ST)
IC1 = v-reg:LM317?*: 500 mA Adjustable Output Positive Voltage Regulator Source: http://www.onsemi.co.jp .. LM317M-D.PDF
IC2 = linear:*317: Positive VOLTAGE REGULATOR
IC3 IC5 = st-microelectronics:L6203: DMOS FULL BRIDGE DRIVER
IC4 IC7 = linear:OPA2*: Dual Operational Amplifier Low Power, Single-Supply, Rail-To-Rail Operational Amplifier Source: http://focus.ti.com/lit/ds/symlink/opa2345.pdf
IC6 = eagle_jbs_lib:MCP32016
IC8 = maxim:MAX232: RS232 TRANSEIVER
IC9 = maxim-10:MAX232*: RS232 TRANSEIVER
IC10 = eagle_jbs_lib:WT11
IC11 = eagle_jbs_lib:DSPIC33FJXXMC804
IC12 = eagle_jbs_lib:ADR443
J1-J5 J10 J11 = con-molex:22-?-04: CONNECTOR wire to board 2.54 mm (.1 inch) pitch header
J6 J7 = con-molex:22-?-03: CONNECTOR wire to board 2.54 mm (.1 inch) pitch header
J8 J9 = con-molex:22-?-09: CONNECTOR wire to board 2.54 mm (.1 inch) pitch header
J12 J13 = con-molex:22-?-05: CONNECTOR wire to board 2.54 mm (.1 inch) pitch header
J14-J16 = con-molex:22-?-02: CONNECTOR wire to board 2.54 mm (.1 inch) pitch header
J17 = con-amp:520470-3: AMP connector
JP1 JP2 = jumper:JP2E: JUMPER
JP3 = jumper:JP4Q: JUMPER
Q1 = crystal:CRYSTAL: CRYSTAL
R1-R5 R7-R45 = rcl:R-US_: RESISTOR, American symbol
R6 = rcl:R-TRIMM: Trimm resistor
S1 = switch-misc:DT: ITT SWITCH
TP1 TP2 = testpad:PTR1: TEST PIN
X1-X8 = con-wago-508:W237-02P: WAGO SREW CLAMP

## Board
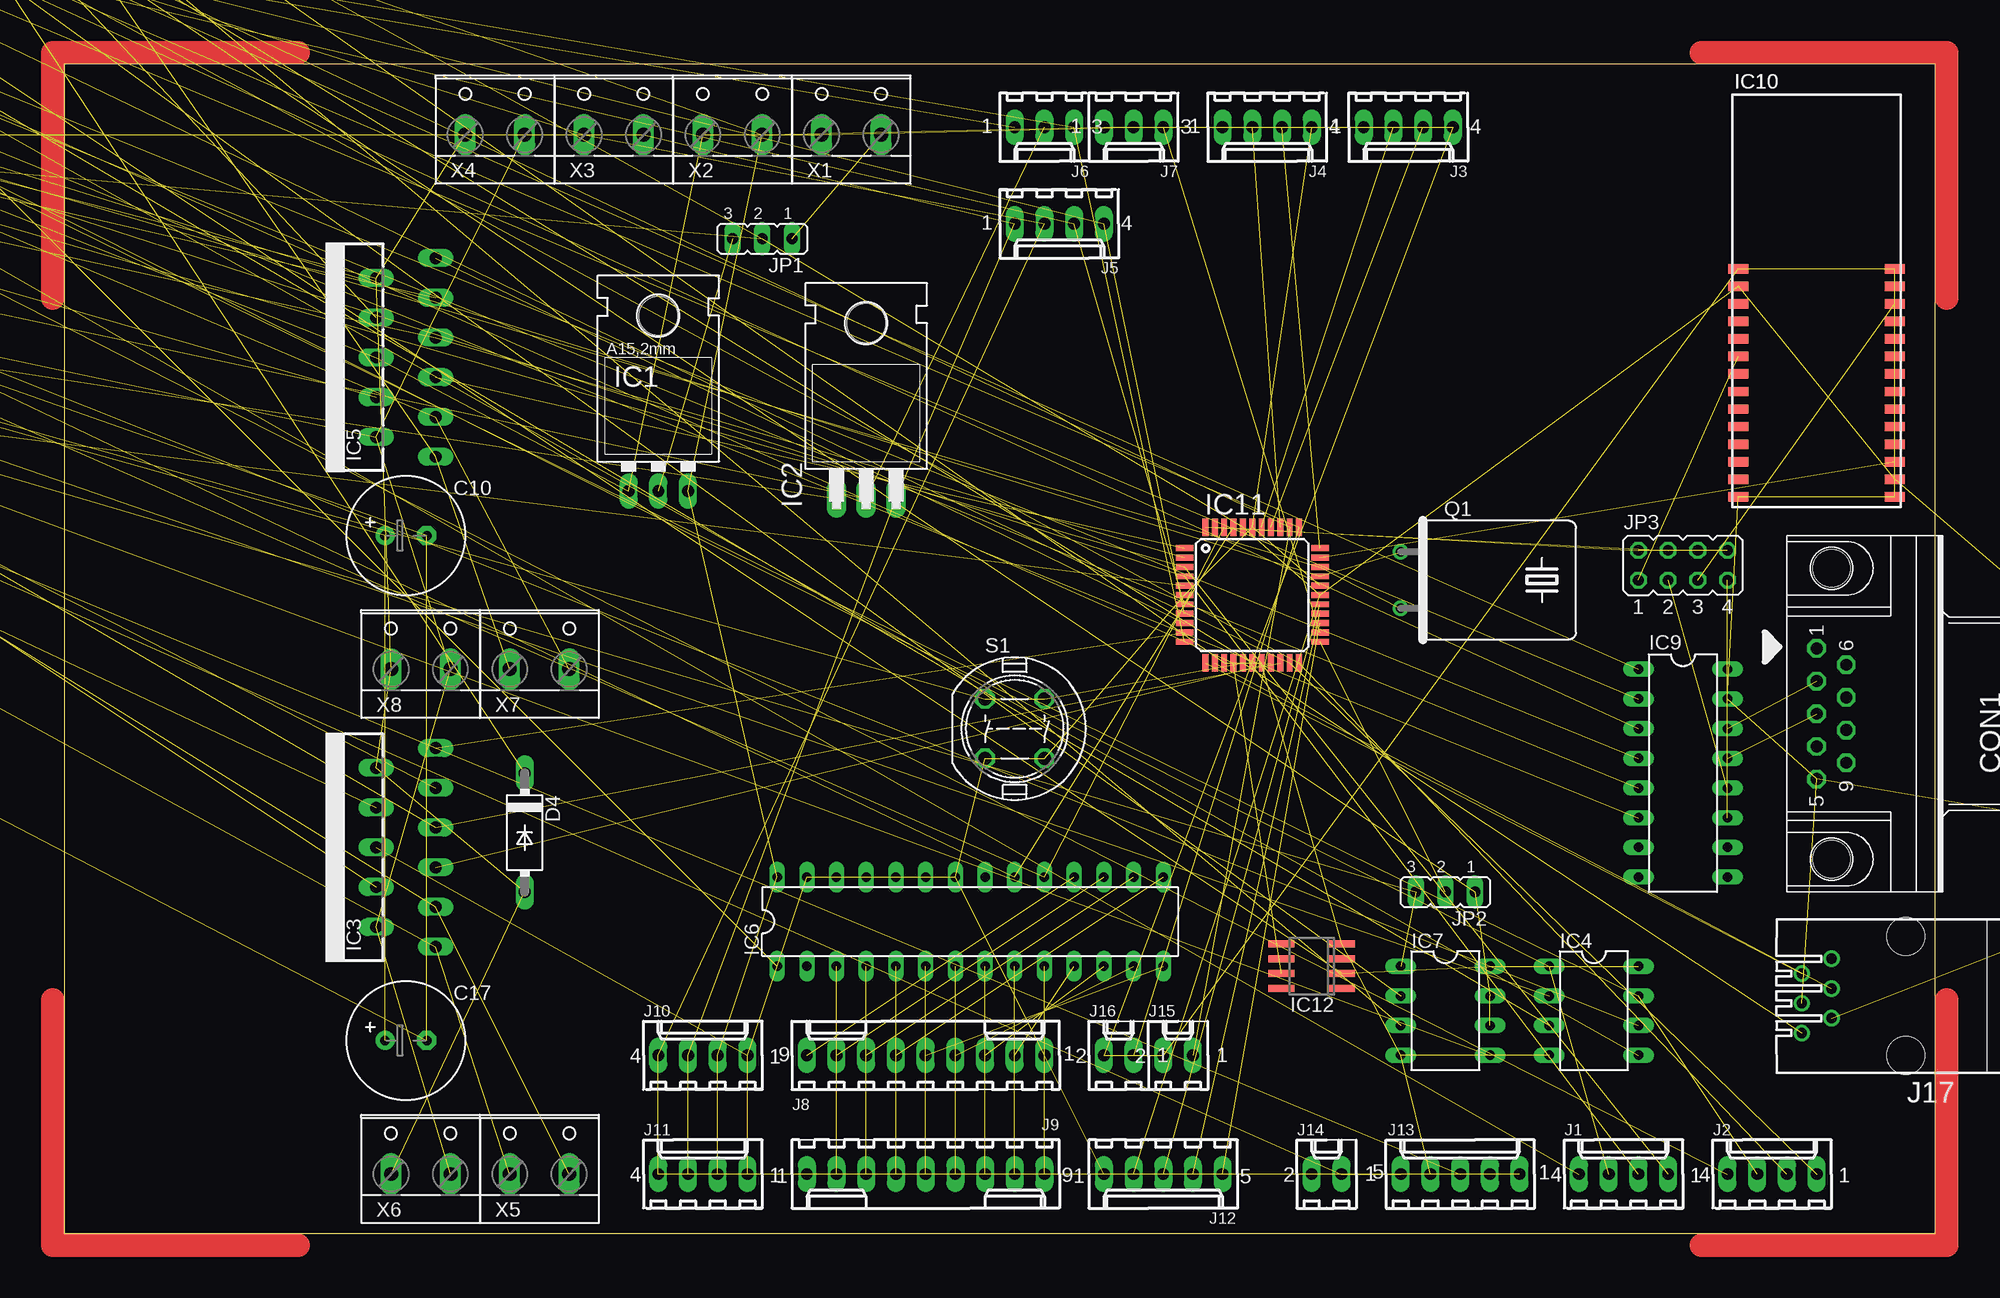
[diagram p7: board, top side]
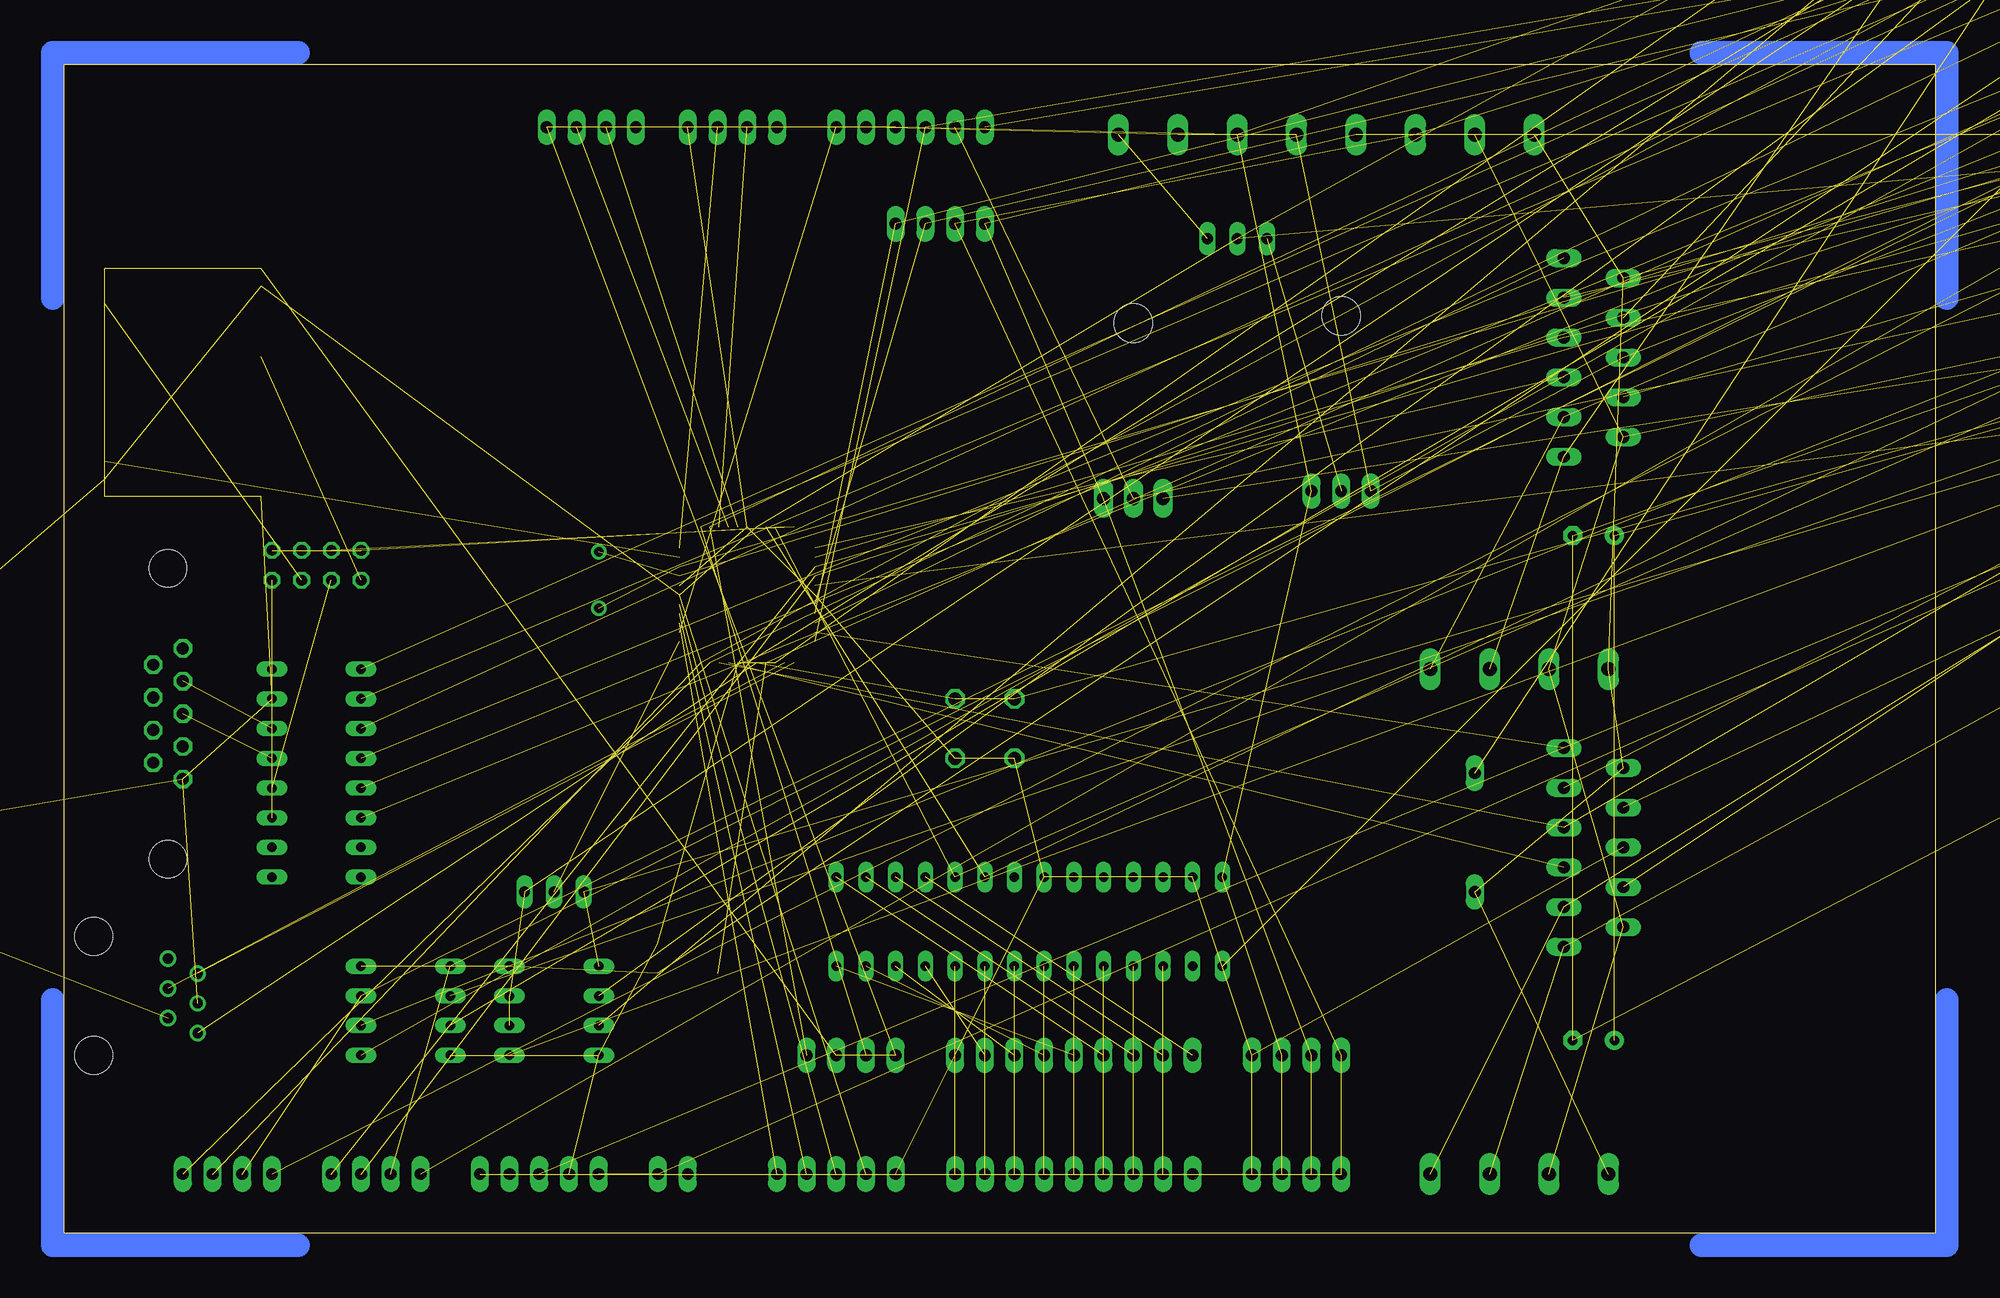
[diagram p8: board, bottom side, seen from below]

Size 160 x 100 mm. Coordinates in mm from the lower left corner, seen from the top.
Outline: 0,0 160,0 160,100 0,100 0,0
Copper layers (1*16): Top 0.035mm / dielectric 1.5mm / Bottom 0.035mm
Design rules "default": minimum track width 10mil, minimum drill 24mil, track to track 8mil, track to pad 8mil, pad to pad 8mil, via to via 8mil, smd to smd 8mil, copper to edge 40mil, drill to drill 8mil, minimum pad ring 10mil, minimum via ring 8mil, stop-mask expansion 4mil, vias tented up to drill 0mil, thermal gap 10mil

### Footprints (pad centres in the part's own frame; a part is rotated, then mirrored left to right if it is on the bottom)
E2-5 = drill 0.813 pad 1.27 round: + -1.016,0 | drill 0.813 pad 1.27 octagon: - 1.016,0
C050-024X044 = drill 0.813 octagon: 1 -2.54,0; 2 2.54,0
E3,5-10 = drill 0.813 pad 1.6 round: + -1.778,0 | drill 0.813 pad 1.6 octagon: - 1.778,0
E3,5-8 = drill 0.813 pad 1.6 round: + -1.778,0 | drill 0.813 pad 1.6 octagon: - 1.778,0
D-09F/90 = drill 1.016 pad 1.575 octagon: 1 -5.588,-1.27; 2 -2.794,-1.27; 3 0,-1.27; 4 2.794,-1.27; 5 5.588,-1.27; 6 -4.191,1.27; 7 -1.397,1.27; 8 1.397,1.27; 9 4.191,1.27 | hole 3.2: 12.446,0; -12.446,0
F126-10 = drill 1.016 long: A 5.08,0; C -5.08,0
TO220L1 = drill 1.016 long: 1 -2.54,-3.81; 2 0,-3.81; 3 2.54,-3.81 | hole 3.302: 0,11.176
TO220H = drill 1.118 long: 1 -2.54,-10.16; 2 0,-10.16; 3 2.54,-10.16 | hole 3.302: 0,4.826
MULTIWATT-11 = drill 1.016 long: 1 -8.5,-6.35; 2 -6.8,-1.27; 3 -5.1,-6.35; 4 -3.4,-1.27; 5 -1.7,-6.35; 6 0,-1.27; 7 1.7,-6.35; 8 3.4,-1.27; 9 5.1,-6.35; 10 6.8,-1.27; 11 8.5,-6.35
DIL08 = drill 0.813 long: 1 -3.81,-3.81; 2 -1.27,-3.81; 3 1.27,-3.81; 4 3.81,-3.81; 5 3.81,3.81; 6 1.27,3.81; 7 -1.27,3.81; 8 -3.81,3.81
DIL28-3 = drill 0.813 long: 1 -16.51,-3.81; 2 -13.97,-3.81; 3 -11.43,-3.81; 4 -8.89,-3.81; 5 -6.35,-3.81; 6 -3.81,-3.81; 7 -1.27,-3.81; 8 1.27,-3.81; 9 3.81,-3.81; 10 6.35,-3.81; 11 8.89,-3.81; 12 11.43,-3.81; 13 13.97,-3.81; 14 16.51,-3.81; 15 16.51,3.81; 16 13.97,3.81; 17 11.43,3.81; 18 8.89,3.81; 19 6.35,3.81; 20 3.81,3.81; 21 1.27,3.81; 22 -1.27,3.81; 23 -3.81,3.81; 24 -6.35,3.81; 25 -8.89,3.81; 26 -11.43,3.81; 27 -13.97,3.81; 28 -16.51,3.81
DIL16 = drill 0.813 long: 1 -8.89,-3.81; 2 -6.35,-3.81; 3 -3.81,-3.81; 4 -1.27,-3.81; 5 1.27,-3.81; 6 3.81,-3.81; 7 6.35,-3.81; 8 8.89,-3.81; 9 8.89,3.81; 10 6.35,3.81; 11 3.81,3.81; 12 1.27,3.81; 13 -1.27,3.81; 14 -3.81,3.81; 15 -6.35,3.81; 16 -8.89,3.81
WT11 = smd 1.7 x 0.8: 1 -6.7,2.5; 2 -6.7,1; 3 -6.7,-0.5; 4 -6.7,-2; 5 -6.7,-3.5; 6 -6.7,-5; 7 -6.7,-6.5; 8 -6.7,-8; 9 -6.7,-9.5; 10 -6.7,-11; 11 -6.7,-12.5; 12 -6.7,-14; 13 -6.7,-15.5; 14 -6.7,-17; 15 6.7,-17; 16 6.7,-15.5; 17 6.7,-14; 18 6.7,-12.5; 19 6.7,-11; 20 6.7,-9.5; 21 6.7,-8; 22 6.7,-6.5; 23 6.7,-5; 24 6.7,-3.5; 25 6.7,-2; 26 6.7,-0.5; 27 6.7,1; 28 6.7,2.5
TQFP44 = smd 1.5 x 0.5: 1 -5.8,4; 2 -5.8,3.2; 3 -5.8,2.4; 4 -5.8,1.6; 5 -5.8,0.8; 6 -5.8,0; 7 -5.8,-0.8; 8 -5.8,-1.6; 9 -5.8,-2.4; 10 -5.8,-3.2; 11 -5.8,-4; 23 5.8,-4; 24 5.8,-3.2; 25 5.8,-2.4; 26 5.8,-1.6; 27 5.8,-0.8; 28 5.8,0; 29 5.8,0.8; 30 5.8,1.6; 31 5.8,2.4; 32 5.8,3.2; 33 5.8,4 | smd 0.5 x 1.5: 12 -4,-5.8; 13 -3.2,-5.8; 14 -2.4,-5.8; 15 -1.6,-5.8; 16 -0.8,-5.8; 17 0,-5.8; 18 0.8,-5.8; 19 1.6,-5.8; 20 2.4,-5.8; 21 3.2,-5.8; 22 4,-5.8; 34 4,5.8; 35 3.2,5.8; 36 2.4,5.8; 37 1.6,5.8; 38 0.8,5.8; 39 0,5.8; 40 -0.8,5.8; 41 -1.6,5.8; 42 -2.4,5.8; 43 -3.2,5.8; 44 -4,5.8
SOIC8 = smd 0.6 x 2.2: 1 -1.905,-2.6; 2 -0.635,-2.6; 3 0.635,-2.6; 4 1.905,-2.6; 5 1.905,2.6; 6 0.635,2.6; 7 -0.635,2.6; 8 -1.905,2.6
6410-04 = drill 1.016 long: 1 3.81,0; 2 1.27,0; 3 -1.27,0; 4 -3.81,0
6410-03 = drill 1.016 long: 1 2.54,0; 2 0,0; 3 -2.54,0
6410-09 = drill 1.016 long: 1 10.16,0; 2 7.62,0; 3 5.08,0; 4 2.54,0; 5 0,0; 6 -2.54,0; 7 -5.08,0; 8 -7.62,0; 9 -10.16,0
6410-05 = drill 1.016 long: 1 5.08,0; 2 2.54,0; 3 0,0; 4 -2.54,0; 5 -5.08,0
6410-02 = drill 1.016 long: 1 1.27,0; 2 -1.27,0
520470-3 = drill 0.889 round: 1 -3.175,8.89; 2 -1.905,6.35; 3 -0.635,8.89; 4 0.635,6.35; 5 1.905,8.89; 6 3.175,6.35 | hole 3.251: -5.08,0; 5.08,0
JP2 = drill 0.914 long: 1 -2.54,0; 2 0,0; 3 2.54,0
JP4Q = drill 0.914 octagon: 1 -3.81,-1.27; 2 -3.81,1.27; 3 -1.27,-1.27; 4 -1.27,1.27; 5 1.27,-1.27; 6 1.27,1.27; 7 3.81,-1.27; 8 3.81,1.27
HC49U-H = drill 0.813 round: 1 -2.413,-5.08; 2 2.413,-5.08
0309/10 = drill 0.813 octagon: 1 -5.08,0; 2 5.08,0
RTRIMT93YA = drill 0.61 round: 1 0,-2.54; 2 0,0; 3 0,2.54
0207/7 = drill 0.813 octagon: 1 -3.81,0; 2 3.81,0
0204/7 = drill 0.813 octagon: 1 -3.81,0; 2 3.81,0
DT6 = drill 1.118 octagon: 1 -2.54,2.54; 2 2.54,2.54; 3 2.54,-2.54; 4 -2.54,-2.54
B2,54 = smd 2.54 x 2.54: PP 0,0
W237-132 = drill 1.194 long: 1 -2.54,-0.635; 2 2.54,-0.635

### Placement (x,y rotation side)
C1  -22.86,93.98 0 top  (outside the outline)
C2  -80.01,135.89 0 top  (outside the outline)
C3  -40.64,93.98 0 top  (outside the outline)
C4  -92.71,135.89 0 top  (outside the outline)
C5  -58.42,93.98 0 top  (outside the outline)
C6  -105.41,135.89 0 top  (outside the outline)
C7  -76.2,93.98 0 top  (outside the outline)
C8  -118.11,135.89 0 top  (outside the outline)
C9  -93.98,93.98 0 top  (outside the outline)
C10  29.21,59.69 0 top
C11  -151.13,92.71 0 top  (outside the outline)
C12  -130.81,135.89 0 top  (outside the outline)
C13  -143.51,135.89 0 top  (outside the outline)
C14  -156.21,135.89 0 top  (outside the outline)
C15  -168.91,135.89 0 top  (outside the outline)
C16  -181.61,135.89 0 top  (outside the outline)
C17  29.21,16.51 0 top
C18  -194.31,135.89 0 top  (outside the outline)
C19  -207.01,135.89 0 top  (outside the outline)
C20  -19.05,143.51 0 top  (outside the outline)
C21  -31.75,143.51 0 top  (outside the outline)
C22  -44.45,143.51 0 top  (outside the outline)
C23  -57.15,143.51 0 top  (outside the outline)
C24  -181.61,92.71 0 top  (outside the outline)
C25  -69.85,143.51 0 top  (outside the outline)
C26  -82.55,143.51 0 top  (outside the outline)
C27  -95.25,143.51 0 top  (outside the outline)
C28  -107.95,143.51 0 top  (outside the outline)
C29  -120.65,143.51 0 top  (outside the outline)
C30  -133.35,143.51 0 top  (outside the outline)
C31  -146.05,143.51 0 top  (outside the outline)
C32  -196.85,92.71 0 top  (outside the outline)
C33  -158.75,143.51 0 top  (outside the outline)
C34  -171.45,143.51 0 top  (outside the outline)
C35  -184.15,143.51 0 top  (outside the outline)
C36  -196.85,143.51 0 top  (outside the outline)
C37  -212.09,92.71 0 top  (outside the outline)
C38  -209.55,143.51 0 top  (outside the outline)
C39  -19.05,151.13 0 top  (outside the outline)
CON1  151.13,44.45 270 top
D1  -64.77,104.14 0 top  (outside the outline)
D2  -82.55,104.14 0 top  (outside the outline)
D3  -100.33,104.14 0 top  (outside the outline)
D4  39.37,34.29 270 top
IC1  50.8,67.31 0 top
IC2  68.58,73.03 0 top
IC3  25.4,33.02 90 top
IC4  130.81,19.05 270 top
IC5  25.4,74.93 90 top
IC6  77.47,26.67 0 top
IC7  118.11,19.05 270 top
IC8  187.96,25.4 270 top  (outside the outline)
IC9  138.43,39.37 270 top
IC10  149.86,80.01 0 top
IC11  101.6,54.61 0 top
IC12  106.68,22.86 90 top
J1  133.35,5.08 0 top
J2  146.05,5.08 0 top
J3  114.94,94.61 180 top
J4  102.87,94.61 180 top
J5  85.09,86.36 180 top
J6  83.82,94.61 180 top
J7  91.44,94.61 180 top
J8  73.66,15.24 0 top
J9  73.66,5.08 180 top
J10  54.61,15.24 0 top
J11  54.61,5.08 0 top
J12  93.98,5.08 180 top
J13  119.38,5.08 0 top
J14  107.95,5.08 0 top
J15  95.25,15.24 0 top
J16  90.17,15.24 0 top
J17  157.48,20.32 90 top
JP1  59.69,85.09 180 top
JP2  118.11,29.21 180 top
JP3  138.43,57.15 0 top
Q1  119.38,55.88 270 top
R1  -135.89,104.14 0 top  (outside the outline)
R2  -153.67,104.14 0 top  (outside the outline)
R3  -171.45,104.14 0 top  (outside the outline)
R4  -189.23,104.14 0 top  (outside the outline)
R5  -207.01,104.14 0 top  (outside the outline)
R6  -105.41,93.98 0 top  (outside the outline)
R7  -21.59,113.03 0 top  (outside the outline)
R8  -39.37,113.03 0 top  (outside the outline)
R9  -57.15,113.03 0 top  (outside the outline)
R10  -74.93,113.03 0 top  (outside the outline)
R11  -92.71,113.03 0 top  (outside the outline)
R12  -110.49,113.03 0 top  (outside the outline)
R13  -128.27,113.03 0 top  (outside the outline)
R14  -146.05,113.03 0 top  (outside the outline)
R15  -163.83,113.03 0 top  (outside the outline)
R16  -181.61,113.03 0 top  (outside the outline)
R17  -199.39,113.03 0 top  (outside the outline)
R18  -21.59,120.65 0 top  (outside the outline)
R19  -39.37,120.65 0 top  (outside the outline)
R20  -57.15,120.65 0 top  (outside the outline)
R21  -74.93,120.65 0 top  (outside the outline)
R22  -92.71,120.65 0 top  (outside the outline)
R23  -110.49,120.65 0 top  (outside the outline)
R24  -128.27,120.65 0 top  (outside the outline)
R25  -146.05,120.65 0 top  (outside the outline)
R26  -163.83,120.65 0 top  (outside the outline)
R27  -181.61,120.65 0 top  (outside the outline)
R28  -73.66,128.27 0 top  (outside the outline)
R29  -88.9,128.27 0 top  (outside the outline)
R30  -104.14,128.27 0 top  (outside the outline)
R31  -119.38,128.27 0 top  (outside the outline)
R32  -134.62,128.27 0 top  (outside the outline)
R33  -149.86,128.27 0 top  (outside the outline)
R34  -199.39,120.65 0 top  (outside the outline)
R35  -165.1,128.27 0 top  (outside the outline)
R36  -21.59,128.27 0 top  (outside the outline)
R37  -180.34,128.27 0 top  (outside the outline)
R38  -39.37,128.27 0 top  (outside the outline)
R39  -195.58,128.27 0 top  (outside the outline)
R40  -57.15,128.27 0 top  (outside the outline)
R41  -210.82,128.27 0 top  (outside the outline)
R42  -20.32,135.89 0 top  (outside the outline)
R43  -35.56,135.89 0 top  (outside the outline)
R44  -50.8,135.89 0 top  (outside the outline)
R45  -66.04,135.89 0 top  (outside the outline)
S1  81.28,43.18 0 top
TP1  -43.18,104.14 0 top  (outside the outline)
TP2  -52.07,104.14 0 top  (outside the outline)
X1  67.31,94.61 0 top
X2  57.15,94.61 0 top
X3  46.99,94.61 0 top
X4  36.83,94.61 0 top
X5  40.64,5.71 0 top
X6  30.48,5.71 0 top
X7  40.64,48.9 0 top
X8  30.48,48.9 0 top

### Tracks (layer width: path | path; a pad name or v marks a point on that pad's centre or on a via)
0V  (17 unrouted)
+3V3  (20 unrouted)
+3V3_ANALOG  (3 unrouted)
+5V  (19 unrouted)
+5V_ANALOG  (9 unrouted)
+12V  (8 unrouted)
+24V  (7 unrouted)
+VREF  (5 unrouted)
AGND  (19 unrouted)
ASCL1  (2 unrouted)
ASDA1  (2 unrouted)
BALIZA_INDEX  (1 unrouted)
BALIZA_PWM  (2 unrouted)
BALIZA_SENSOR_1  (2 unrouted)
BALIZA_SENSOR_2  (2 unrouted)
COLOR  (2 unrouted)
FROM_TX_RS232_M  (1 unrouted)
GND  (52 unrouted)
GND_ADJ  (5 unrouted)
GNDIO  (8 unrouted)
I_LASER  (2 unrouted)
LASER  (1 unrouted)
M_DER_#START_STOP  (2 unrouted)
M_DER_EN  (1 unrouted)
M_DER_IN1/VREF_N  (1 unrouted)
M_DER_IN2/VREF_P  (2 unrouted)
M_DER_INDEX  (1 unrouted)
M_DER_REV  (2 unrouted)
M_DER_VREF  (2 unrouted)
M_IZQ_#START_STOP  (2 unrouted)
M_IZQ_EN  (1 unrouted)
M_IZQ_IN1/VREF_N  (1 unrouted)
M_IZQ_IN2/VREF_P  (2 unrouted)
M_IZQ_INDEX  (1 unrouted)
M_IZQ_REV  (2 unrouted)
M_IZQ_VREF  (2 unrouted)
N$1  (1 unrouted)
N$2  (2 unrouted)
N$3  (1 unrouted)
N$4  (1 unrouted)
N$5  (1 unrouted)
N$6  (1 unrouted)
N$7  (1 unrouted)
N$8  (1 unrouted)
N$9  (2 unrouted)
N$10  (1 unrouted)
N$11  (2 unrouted)
N$12  (1 unrouted)
N$13  (2 unrouted)
N$14  (3 unrouted)
N$15  (1 unrouted)
N$16  (1 unrouted)
N$17  (1 unrouted)
N$18  (1 unrouted)
N$19  (1 unrouted)
N$20  (1 unrouted)
N$21  (2 unrouted)
N$22  (2 unrouted)
N$23  (2 unrouted)
N$24  (1 unrouted)
N$25  (2 unrouted)
N$26  (2 unrouted)
N$27  (1 unrouted)
N$28  (3 unrouted)
N$29  (2 unrouted)
N$30  (1 unrouted)
N$31  (1 unrouted)
N$32  (1 unrouted)
N$33  (1 unrouted)
N$34  (1 unrouted)
N$35  (1 unrouted)
N$36  (2 unrouted)
N$37  (1 unrouted)
N$38  (2 unrouted)
N$39  (2 unrouted)
N$40  (2 unrouted)
N$41  (1 unrouted)
N$42  (1 unrouted)
N$43  (1 unrouted)
N$44  (1 unrouted)
N$45  (1 unrouted)
N$46  (1 unrouted)
N$47  (1 unrouted)
N$48  (1 unrouted)
N$49  (1 unrouted)
N$50  (1 unrouted)
N$51  (1 unrouted)
N$52  (1 unrouted)
N$53  (1 unrouted)
N$54  (1 unrouted)
N$55  (1 unrouted)
N$56
  Top 2: 20,-1 -1,-1 -1,20
N$57
  Top 2: 140,-1 161,-1 161,20
N$58
  Top 2: 20,101 -1,101 -1,80
N$59
  Top 2: 161,80 161,101 140,101
N$60
  Bottom 2: 20,-1 -1,-1 -1,20
N$61
  Bottom 2: 140,-1 161,-1 161,20
N$62
  Bottom 2: 20,101 -1,101 -1,80
N$63
  Bottom 2: 161,80 161,101 140,101
PGEC1  (1 unrouted)
PGED1  (1 unrouted)
QEA1  (1 unrouted)
QEA2  (1 unrouted)
QEB1  (1 unrouted)
QEB2  (1 unrouted)
RST  (4 unrouted)
RST_BLUE  (1 unrouted)
RX_BLUE  (1 unrouted)
RX_CABLE  (1 unrouted)
SCK1  (1 unrouted)
SDI1  (1 unrouted)
SDO1  (1 unrouted)
START  (2 unrouted)
TO_RX_RS232_M  (1 unrouted)
TX_BLUE  (1 unrouted)
TX_CABLE  (1 unrouted)
U1RX  (2 unrouted)
U1TX  (2 unrouted)
V_LASER  (3 unrouted)
VPOT_ADJ  (4 unrouted)